# EAGLE schematic Open-Controller-Unitary_V1 (EAGLE 9.1.0)
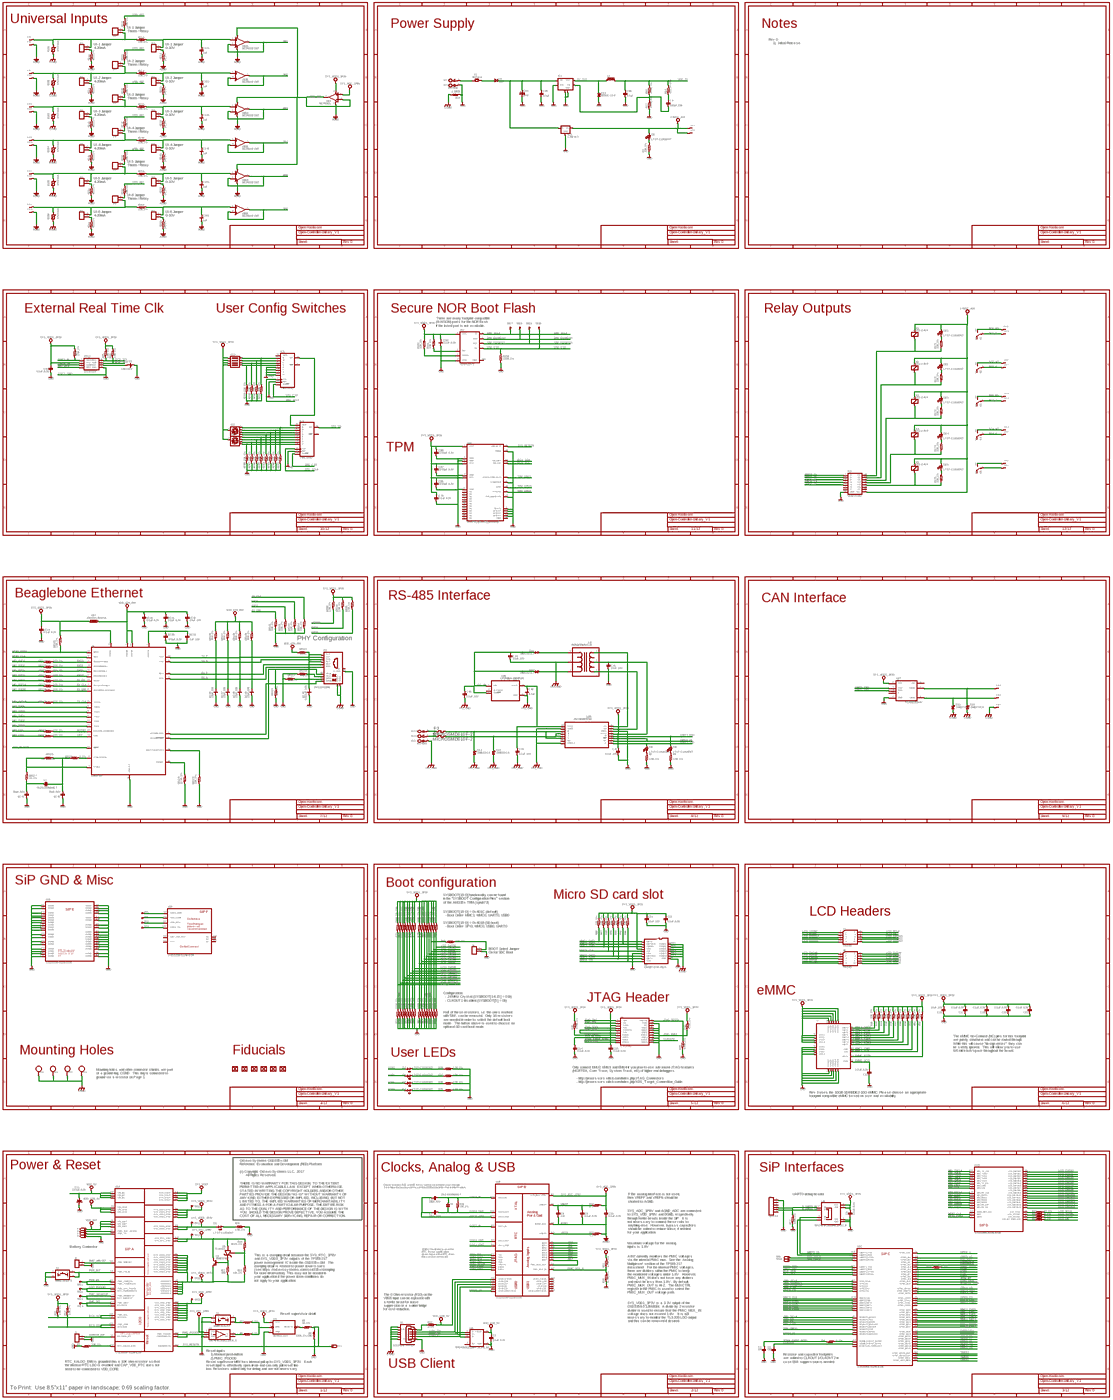
[diagram p0: schematic, sheet 1, overview]
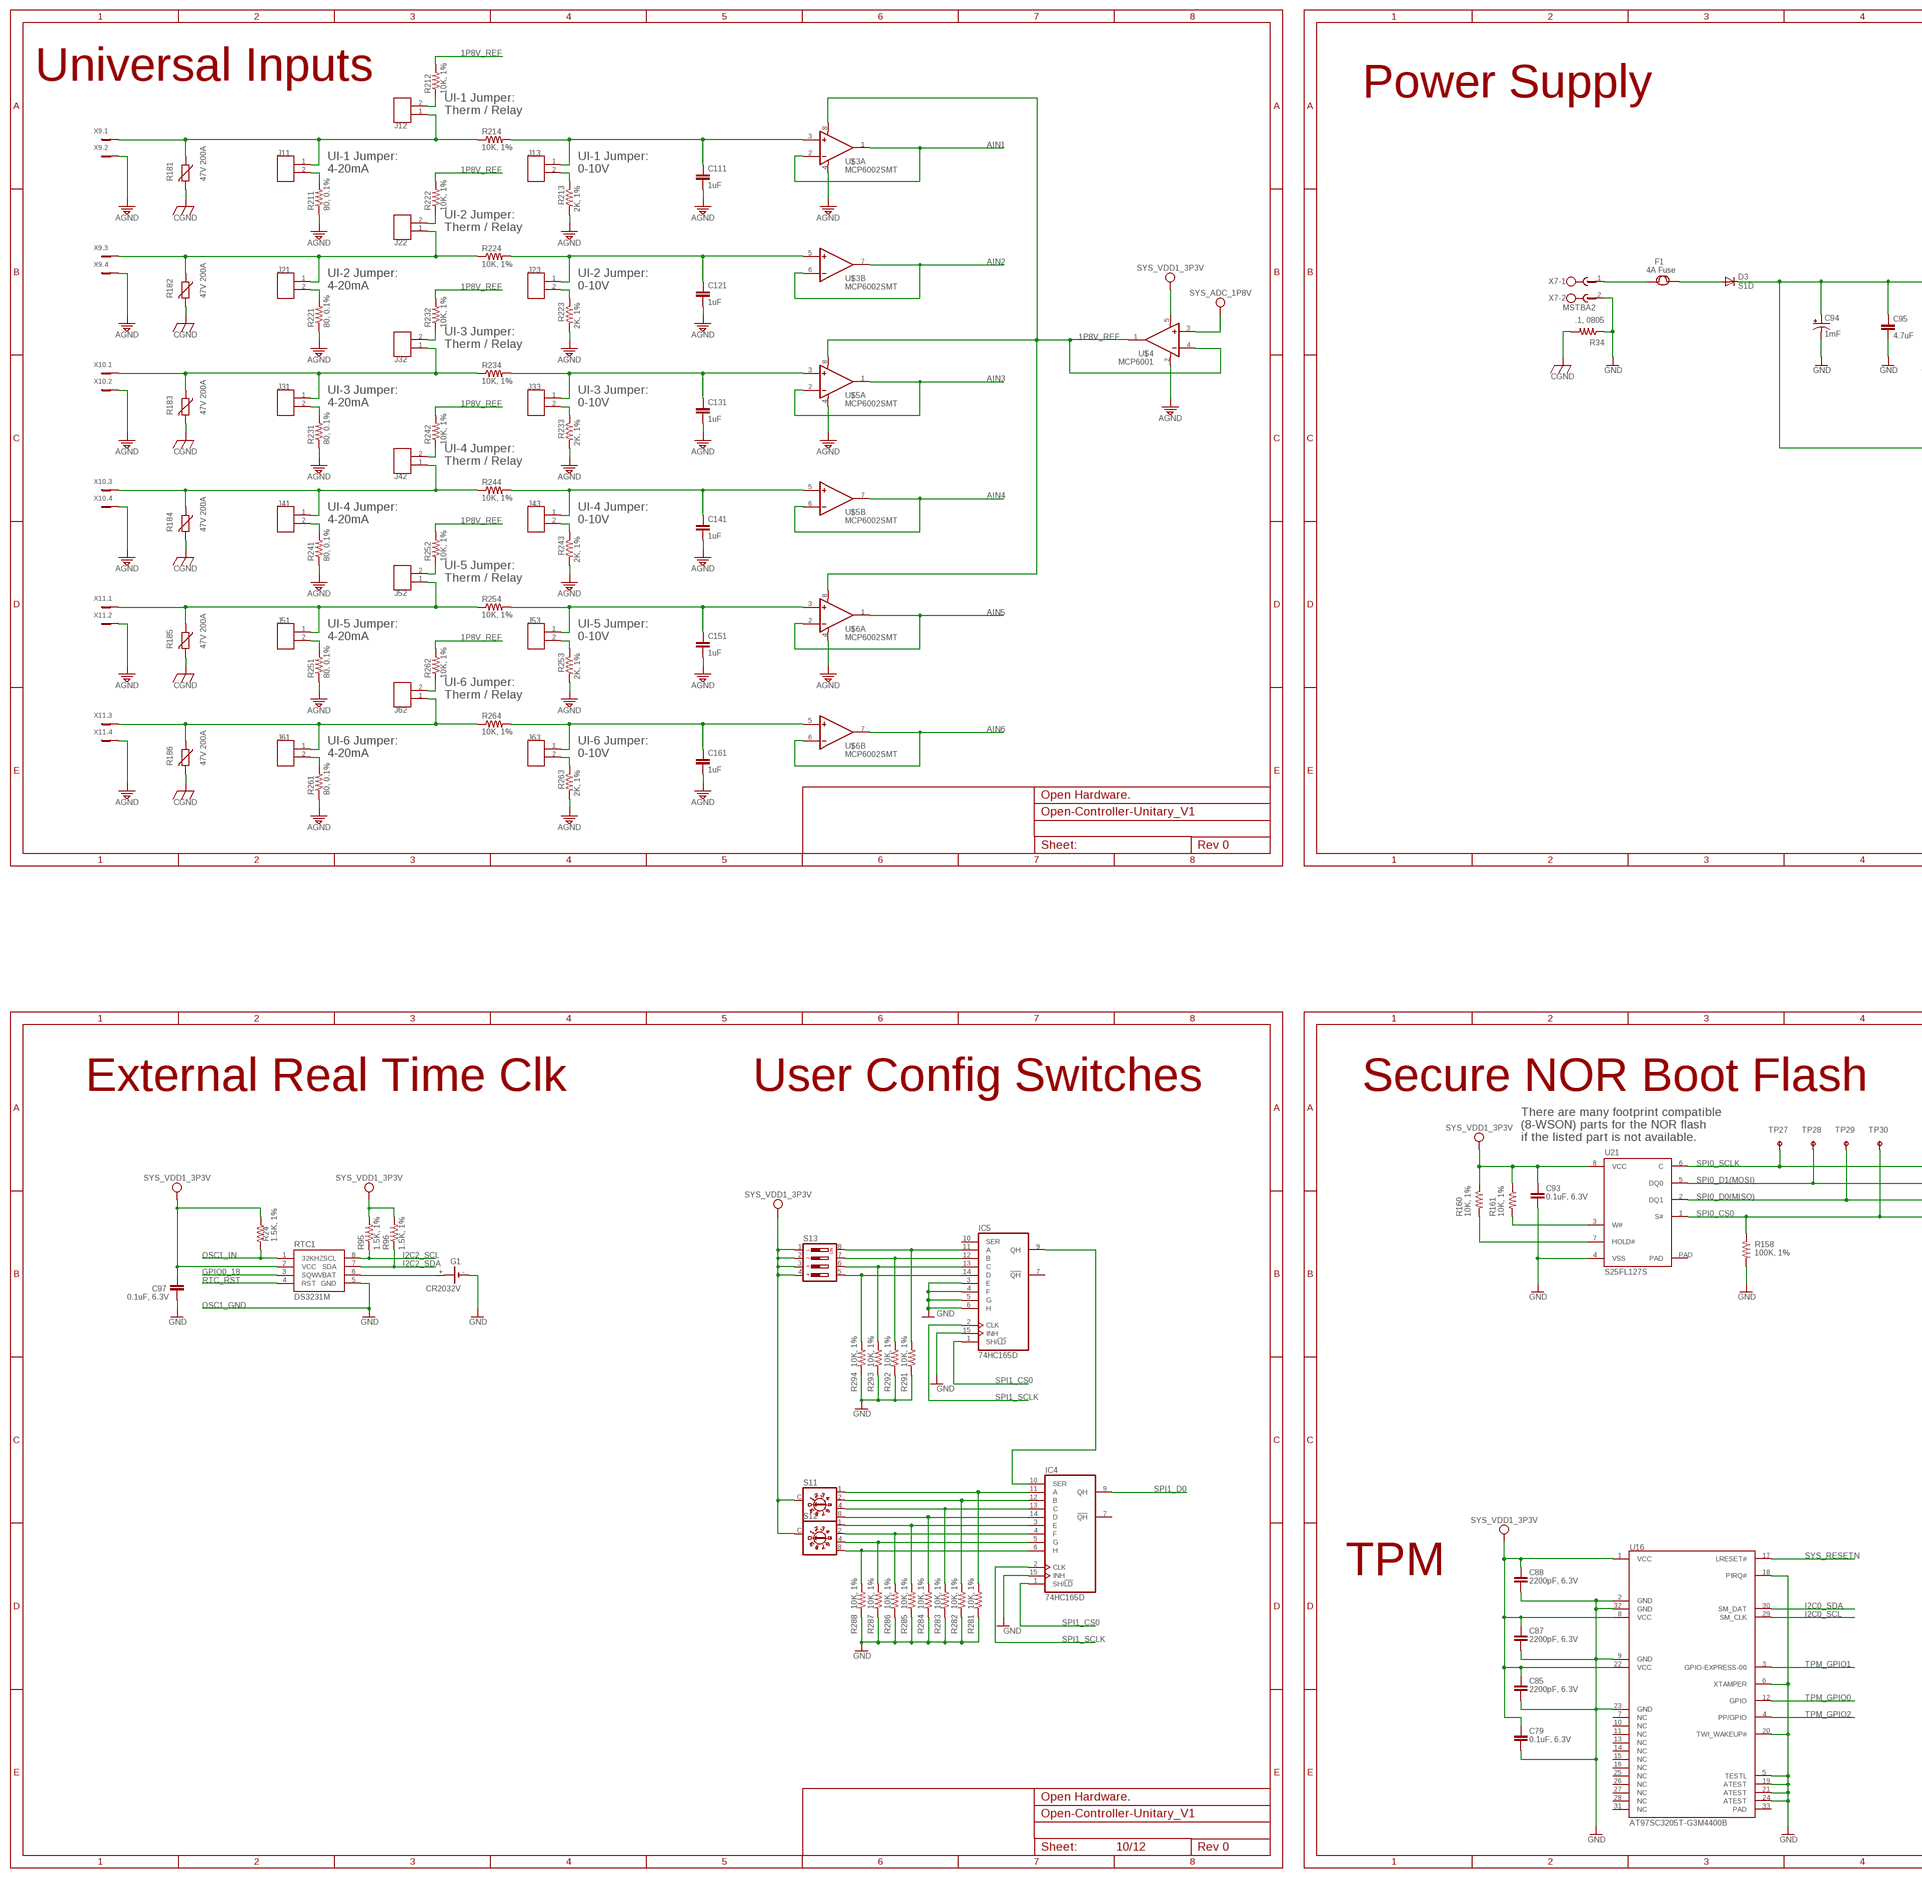
[diagram p1: schematic, sheet 1, part 1 of 6]
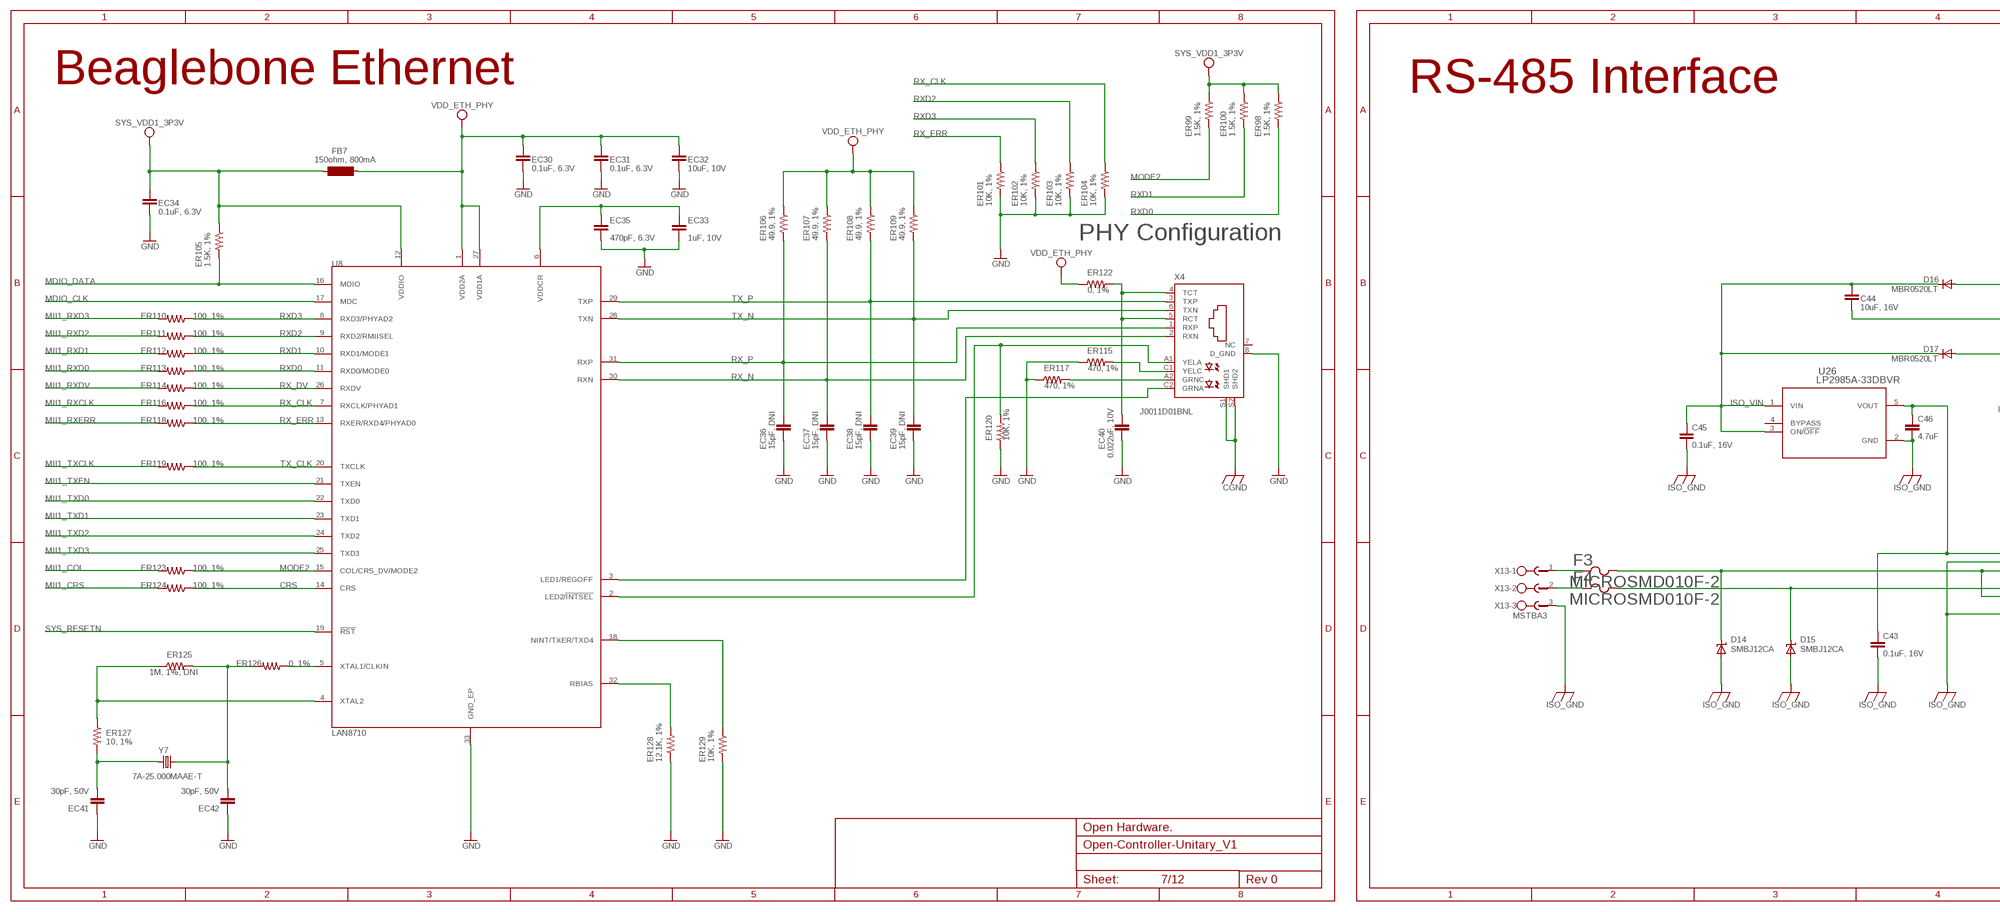
[diagram p2: schematic, sheet 1, part 2 of 6]
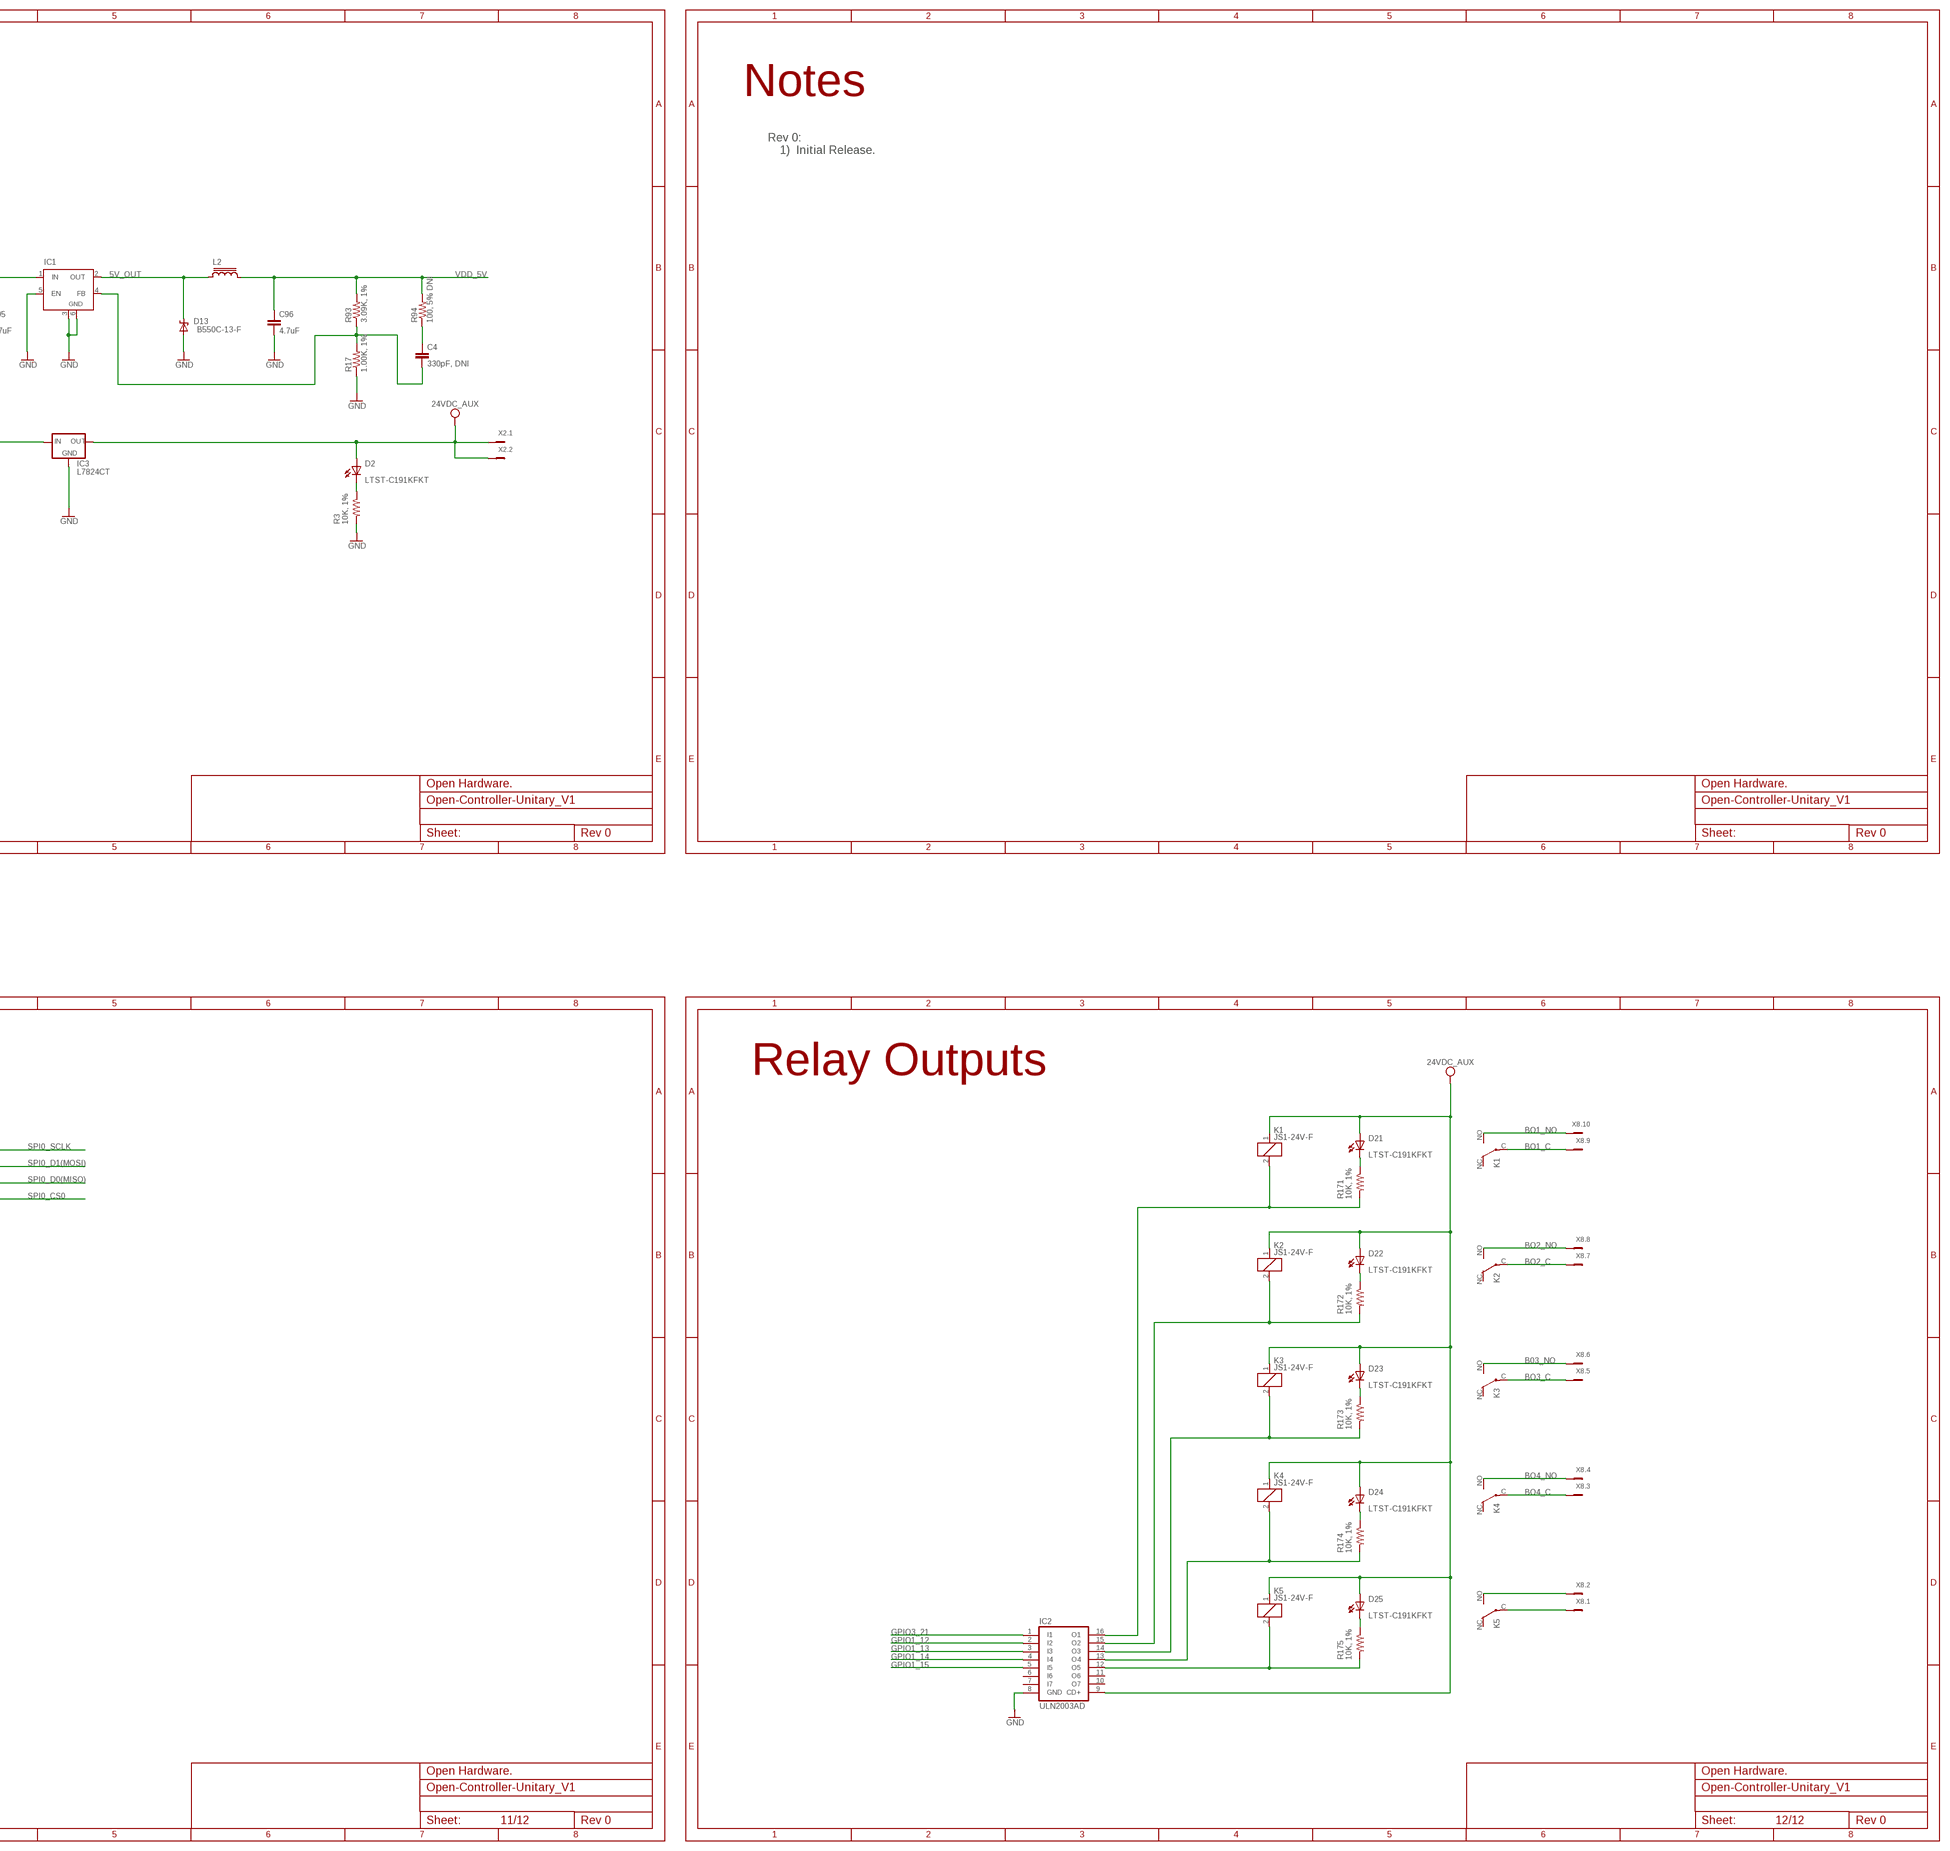
[diagram p3: schematic, sheet 1, part 3 of 6]
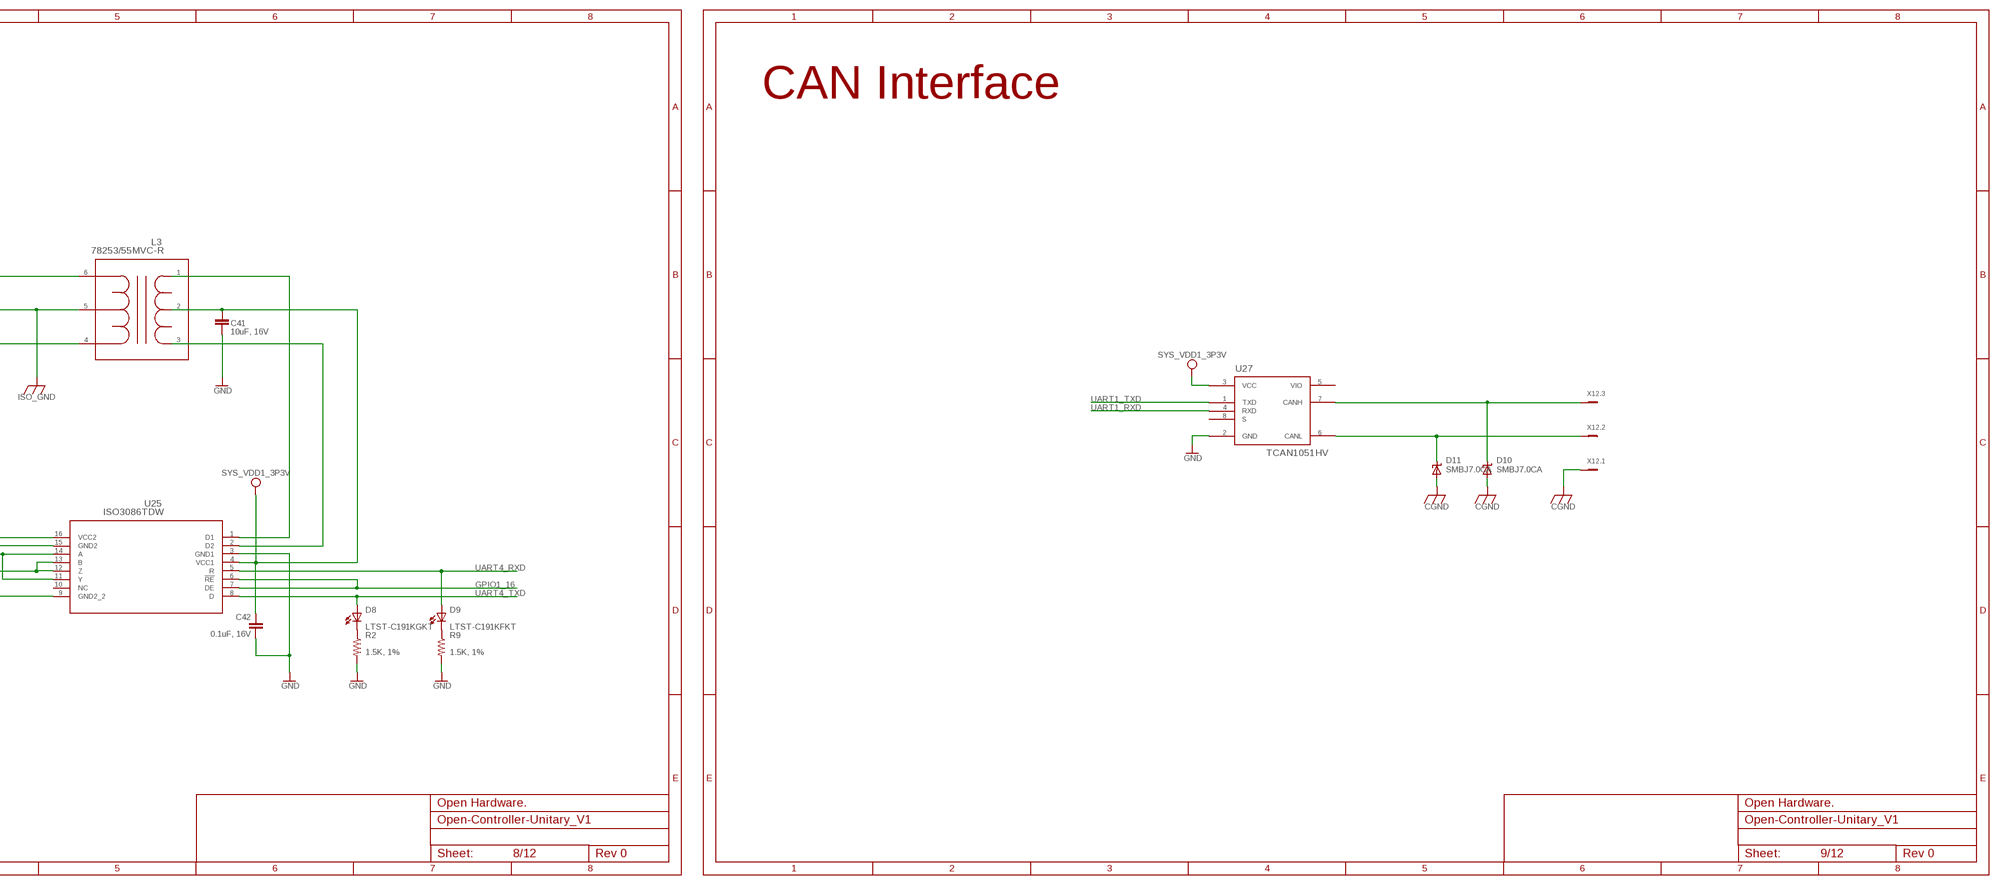
[diagram p4: schematic, sheet 1, part 4 of 6]
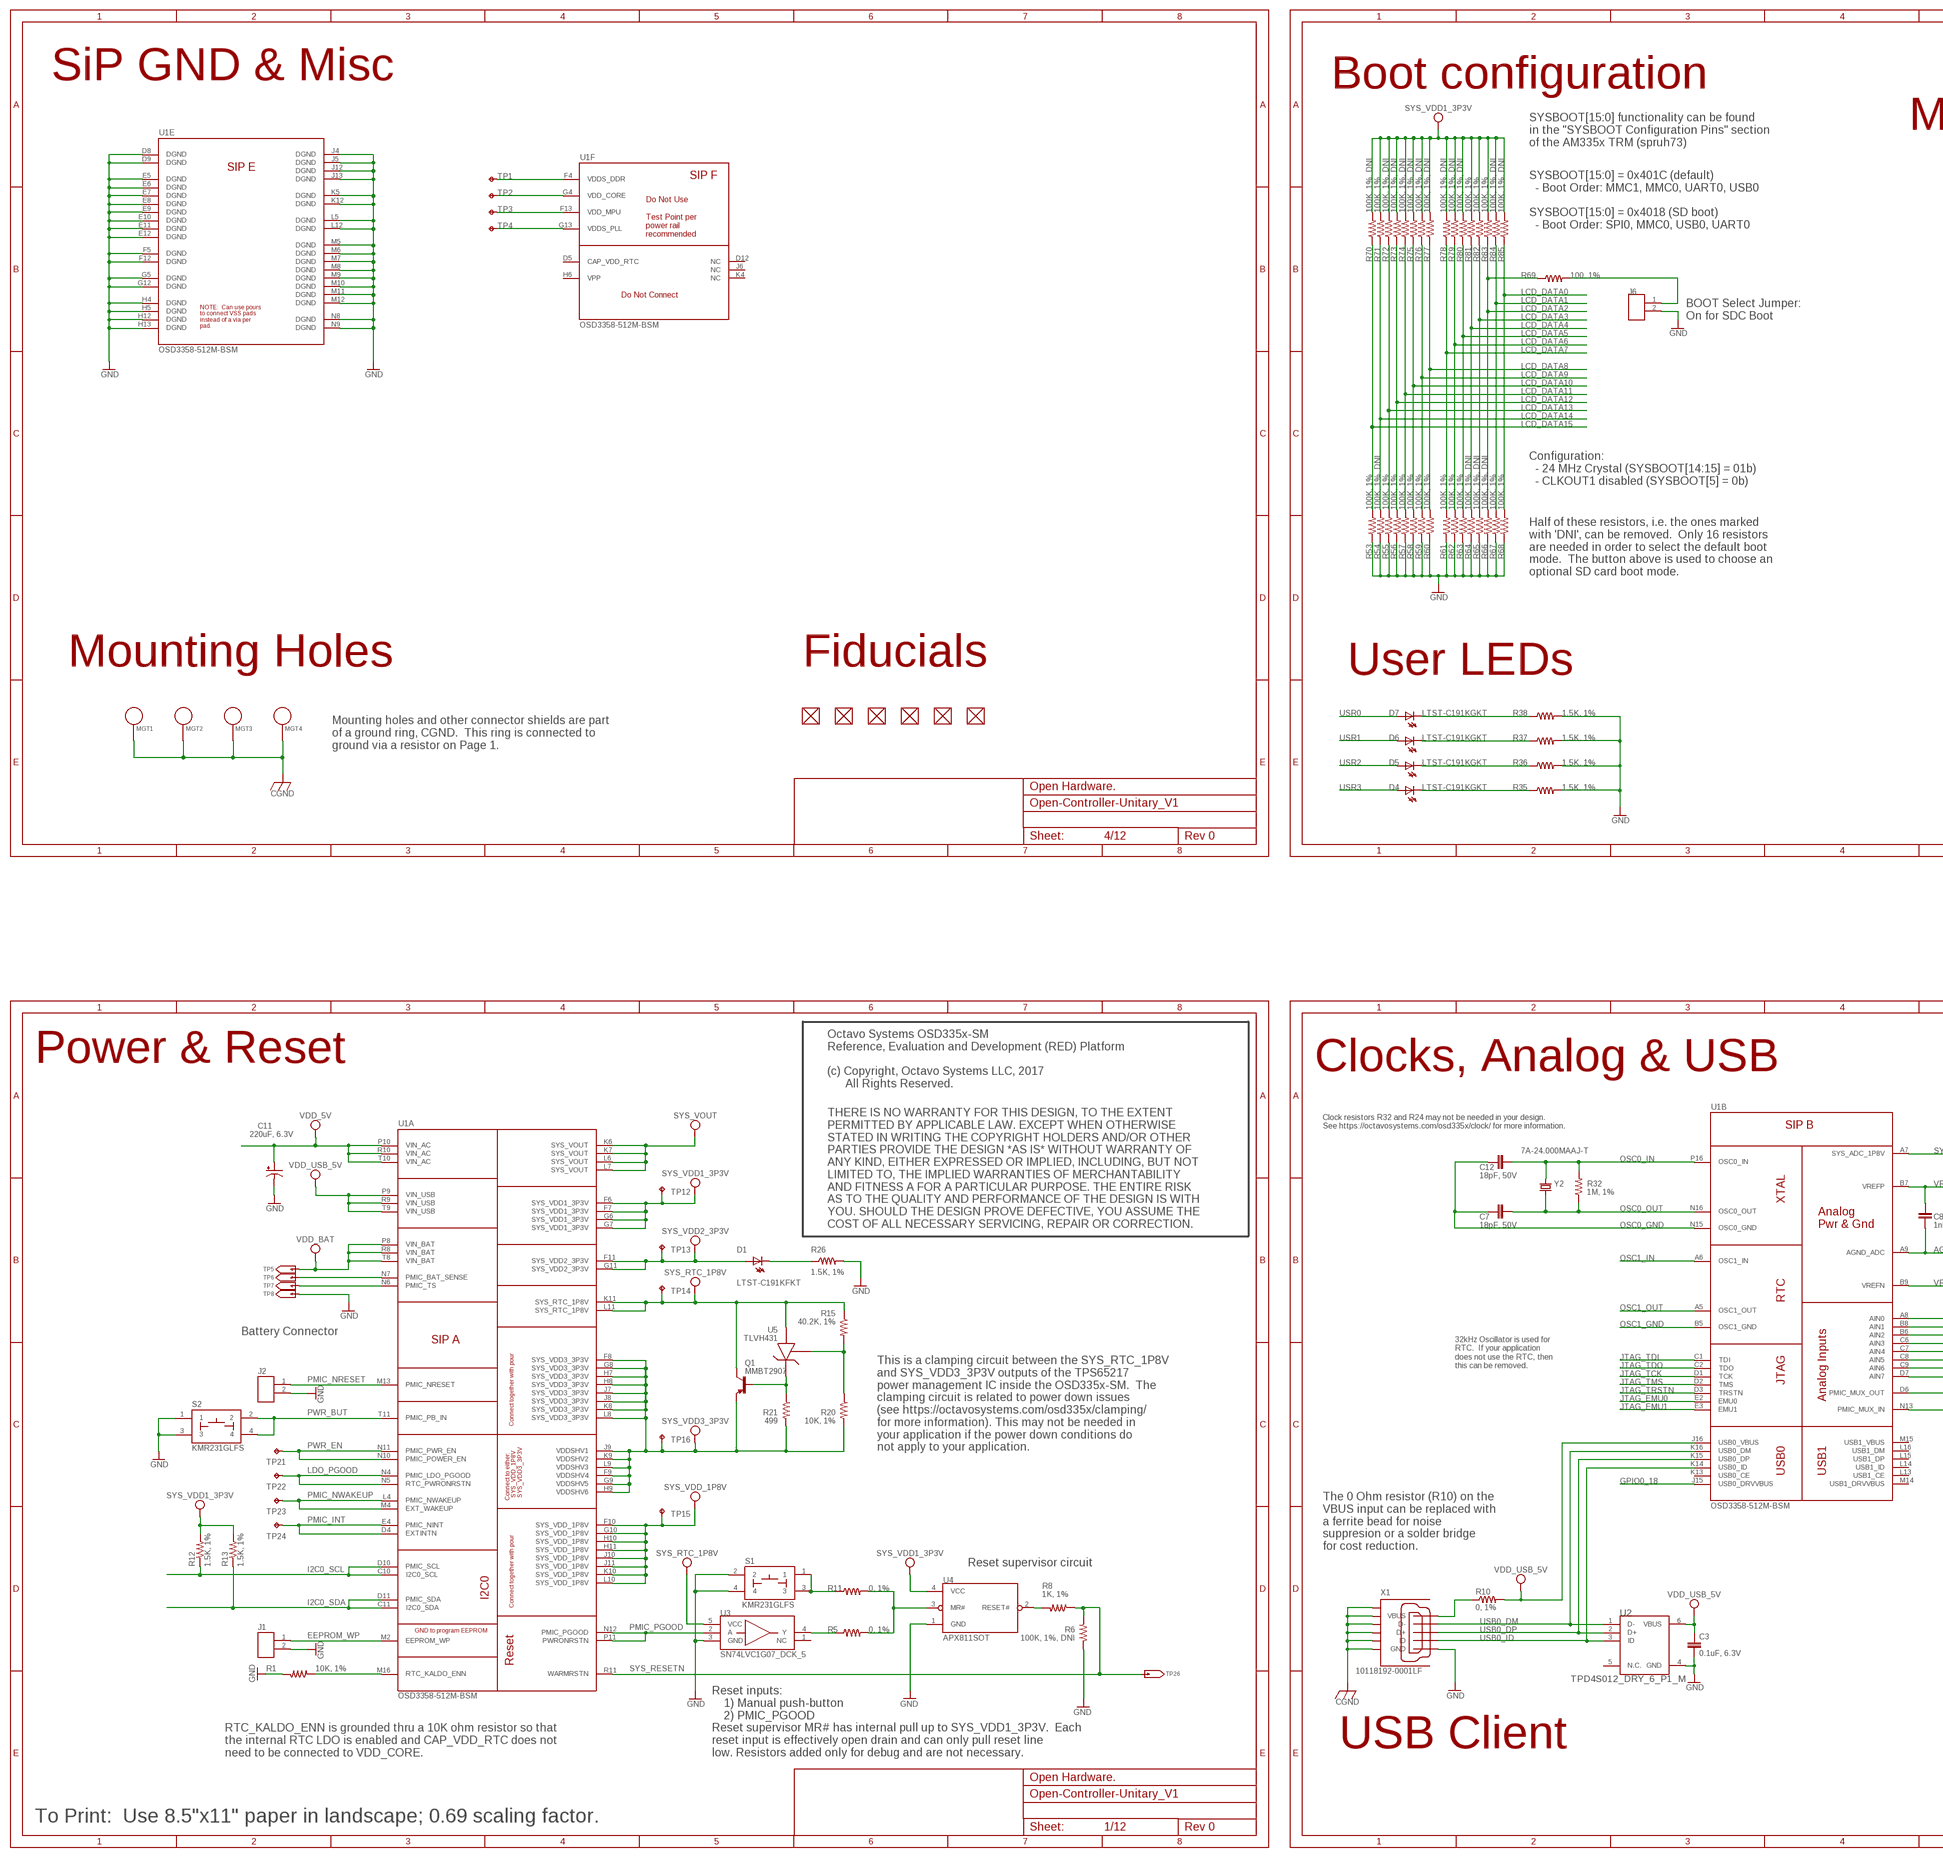
[diagram p5: schematic, sheet 1, part 5 of 6]
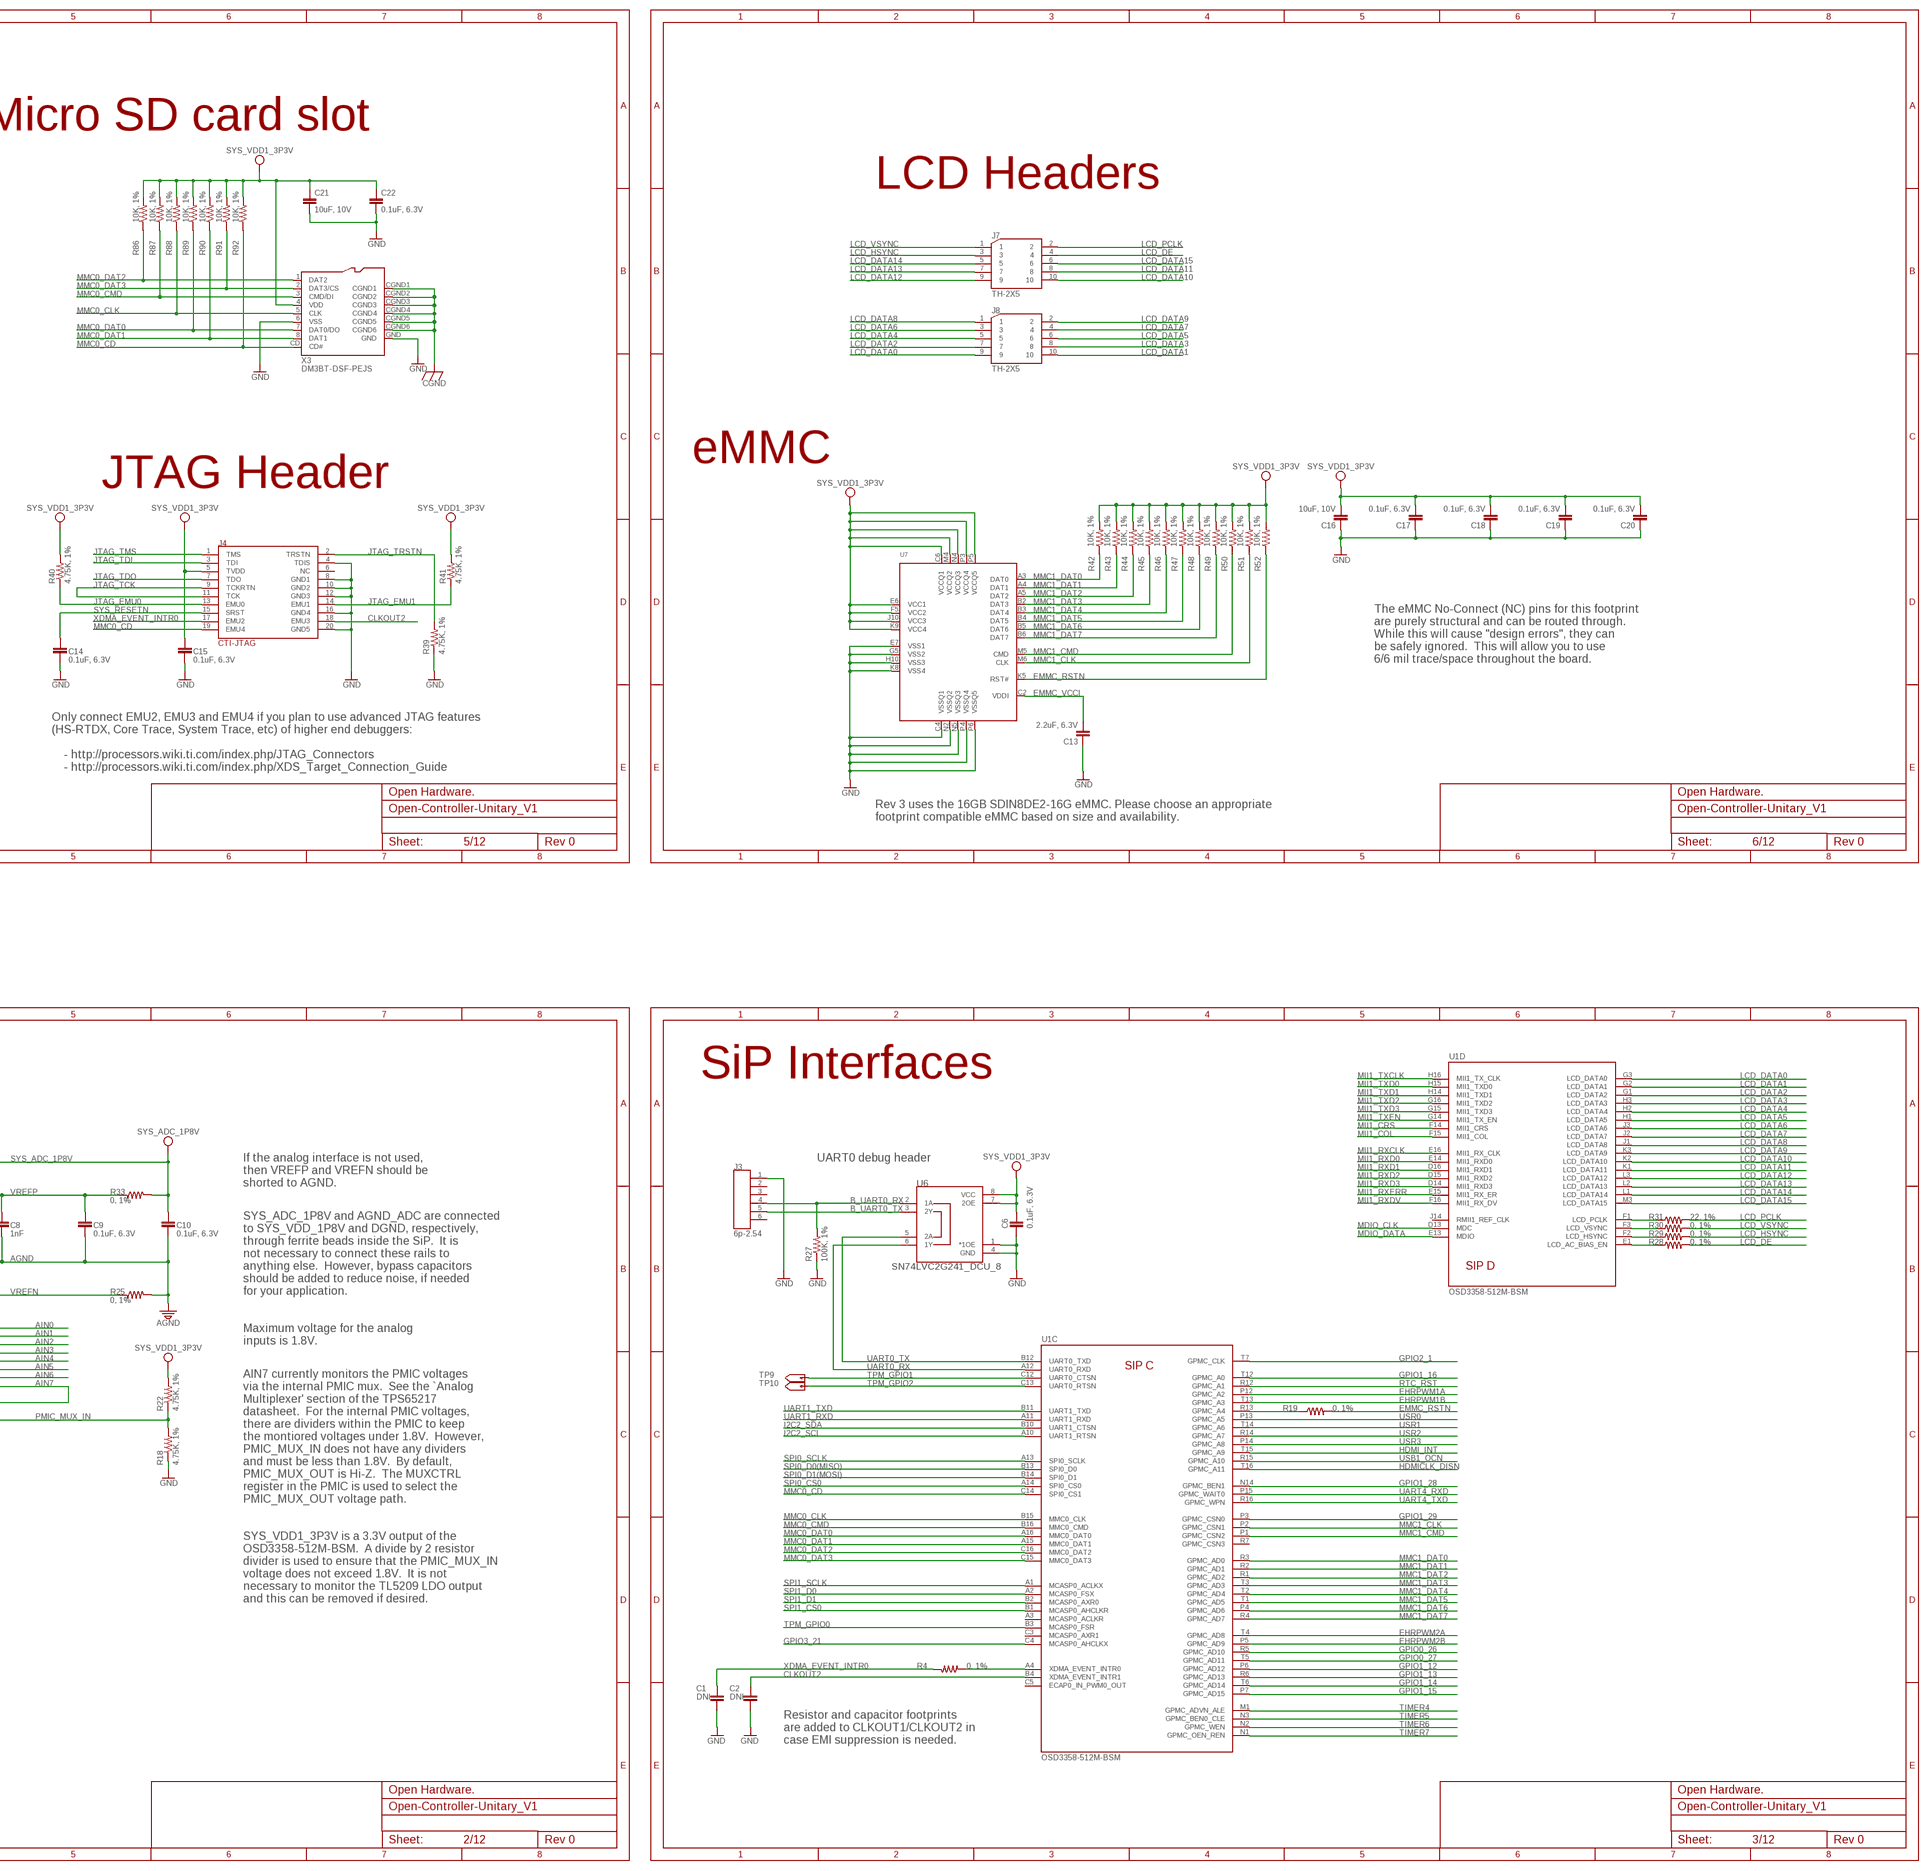
[diagram p6: schematic, sheet 1, part 6 of 6]

## Parts
C1  DNI  CC0603  [C0603]
C2  DNI  CC0603  [C0603]
C3  0.1uF, 6.3V  CC0402  [C0402]
C4  330pF, DNI  CC0805  [C0805]
C6  0.1uF, 6.3V  CC0402  [C0402]
C7  18pF, 50V  CC0402  [C0402]
C8  1nF  CC0402  [C0402]
C9  0.1uF, 6.3V  CC0402  [C0402]
C10  0.1uF, 6.3V  CC0402  [C0402]
C11  220uF, 6.3V  CPOL-USB/3528-21R  [B/3528-21R]
C12  18pF, 50V  CC0402  [C0402]
C13  2.2uF, 6.3V  CC0402  [C0402]
C14  0.1uF, 6.3V  CC0402  [C0402]
C15  0.1uF, 6.3V  CC0402  [C0402]
C16  10uF, 10V  CC0805  [C0805]
C17  0.1uF, 6.3V  CC0402  [C0402]
C18  0.1uF, 6.3V  CC0402  [C0402]
C19  0.1uF, 6.3V  CC0402  [C0402]
C20  0.1uF, 6.3V  CC0402  [C0402]
C21  10uF, 10V  CC0805  [C0805]
C22  0.1uF, 6.3V  CC0402  [C0402]
C41  10uF, 16V  CC0805  [C0805]
C42  0.1uF, 16V  CC0402  [C0402]
C43  0.1uF, 16V  CC0402  [C0402]
C44  10uF, 16V  CC0805  [C0805]
C45  0.1uF, 16V  CC0402  [C0402]
C46  4.7uF  4.7UF-1206-16V-(+80/-20%)  [1206]
C79  0.1uF, 6.3V  CC0402  [C0402]
C85  2200pF, 6.3V  CC0402  [C0402]
C87  2200pF, 6.3V  CC0402  [C0402]
C88  2200pF, 6.3V  CC0402  [C0402]
C93  0.1uF, 6.3V  CC0402  [C0402]
C94  1mF  1000UF-RADIAL-5MM-25V-20%  [CPOL-RADIAL-5MM-10MM]
C95  4.7uF  4.7UF-1206-16V-(+80/-20%)  [1206]
C96  4.7uF  4.7UF-1206-16V-(+80/-20%)  [1206]
C97  0.1uF, 6.3V  CC0402  [C0402]
C111  1uF  CC0805  [C0805]
C121  1uF  CC0805  [C0805]
C131  1uF  CC0805  [C0805]
C141  1uF  CC0805  [C0805]
C151  1uF  CC0805  [C0805]
C161  1uF  CC0805  [C0805]
D1  LTST-C191KFKT  LTST-C191KFKTLED_EIA-STD  [EIA-STD]
D2  LTST-C191KFKT  LTST-C191KFKTLED_EIA-STD  [EIA-STD]
D3  S1D  S1M  [SMA]
D4  LTST-C191KGKT  LTST-C191KGKTLED_EIA-STD  [EIA-STD]
D5  LTST-C191KGKT  LTST-C191KGKTLED_EIA-STD  [EIA-STD]
D6  LTST-C191KGKT  LTST-C191KGKTLED_EIA-STD  [EIA-STD]
D7  LTST-C191KGKT  LTST-C191KGKTLED_EIA-STD  [EIA-STD]
D8  LTST-C191KGKT  LTST-C191KGKTLED_EIA-STD  [EIA-STD]
D9  LTST-C191KFKT  LTST-C191KFKTLED_EIA-STD  [EIA-STD]
D10  SMBJ7.0CA  SUPPRESSOR-SMBJ  [SMBJ]
D11  SMBJ7.0CA  SUPPRESSOR-SMBJ  [SMBJ]
D13  B550C-13-F  B520C-13-F  [SMC]
D14  SMBJ12CA  SUPPRESSOR-SMBJ  [SMBJ]
D15  SMBJ12CA  SUPPRESSOR-SMBJ  [SMBJ]
D16  MBR0520LT  [SOD123]
D17  MBR0520LT  [SOD123]
D21  LTST-C191KFKT  LTST-C191KFKTLED_EIA-STD  [EIA-STD]
D22  LTST-C191KFKT  LTST-C191KFKTLED_EIA-STD  [EIA-STD]
D23  LTST-C191KFKT  LTST-C191KFKTLED_EIA-STD  [EIA-STD]
D24  LTST-C191KFKT  LTST-C191KFKTLED_EIA-STD  [EIA-STD]
D25  LTST-C191KFKT  LTST-C191KFKTLED_EIA-STD  [EIA-STD]
EC30  0.1uF, 6.3V  CC0402  [C0402]
EC31  0.1uF, 6.3V  CC0402  [C0402]
EC32  10uF, 10V  CC0805  [C0805]
EC33  1uF, 10V  CC0402  [C0402]
EC34  0.1uF, 6.3V  CC0402  [C0402]
EC35  470pF, 6.3V  CC0402  [C0402]
EC36  15pF, DNI  CC0402  [C0402]
EC37  15pF, DNI  CC0402  [C0402]
EC38  15pF, DNI  CC0402  [C0402]
EC39  15pF, DNI  CC0402  [C0402]
EC40  0.022uF, 10V  CC0402  [C0402]
EC41  30pF, 50V  CC0402  [C0402]
EC42  30pF, 50V  CC0402  [C0402]
ER98  1.5K, 1%  R-US_R0402  [R0402]
ER99  1.5K, 1%  R-US_R0402  [R0402]
ER100  1.5K, 1%  R-US_R0402  [R0402]
ER101  10K, 1%  R-US_R0402  [R0402]
ER102  10K, 1%  R-US_R0402  [R0402]
ER103  10K, 1%  R-US_R0402  [R0402]
ER104  10K, 1%  R-US_R0402  [R0402]
ER105  1.5K, 1%  R-US_R0402  [R0402]
ER106  49.9, 1%  R-US_R0402  [R0402]
ER107  49.9, 1%  R-US_R0402  [R0402]
ER108  49.9, 1%  R-US_R0402  [R0402]
ER109  49.9, 1%  R-US_R0402  [R0402]
ER110  100, 1%  R-US_R0402  [R0402]
ER111  100, 1%  R-US_R0402  [R0402]
ER112  100, 1%  R-US_R0402  [R0402]
ER113  100, 1%  R-US_R0402  [R0402]
ER114  100, 1%  R-US_R0402  [R0402]
ER115  470, 1%  R-US_R0402  [R0402]
ER116  100, 1%  R-US_R0402  [R0402]
ER117  470, 1%  R-US_R0402  [R0402]
ER118  100, 1%  R-US_R0402  [R0402]
ER119  100, 1%  R-US_R0402  [R0402]
ER120  10K, 1%  R-US_R0402  [R0402]
ER122  0, 1%  R-US_R0402  [R0402]
ER123  100, 1%  R-US_R0402  [R0402]
ER124  100, 1%  R-US_R0402  [R0402]
ER125  1M, 1%, DNI  R-US_R0402  [R0402]
ER126  0, 1%  R-US_R0402  [R0402]
ER127  10, 1%  R-US_R0402  [R0402]
ER128  12.1K, 1%  R-US_R0402  [R0402]
ER129  10K, 1%  R-US_R0402  [R0402]
F1  4A Fuse  FUSE'1206-WIDE'  [F1206W]
F3  MICROSMD010F-2  [FUS_MICROSMD010F_TYCO]
F4  MICROSMD010F-2  [FUS_MICROSMD010F_TYCO]
FB7  150ohm, 800mA  BLM21AG151SN1DFB_0805  [C0805]
FUD1  FIDUCIAL  [FIDUCIAL_40MIL]
FUD2  FIDUCIAL  [FIDUCIAL_40MIL]
FUD3  FIDUCIAL  [FIDUCIAL_40MIL]
FUD4  FIDUCIAL  [FIDUCIAL_40MIL]
FUD5  FIDUCIAL  [FIDUCIAL_40MIL]
FUD6  FIDUCIAL  [FIDUCIAL_40MIL]
G1  CR2032V  [CR2032V]
IC1  LM2596S  [TO263-5]
IC2  ULN2003AD  [SO16]
IC3  L7824CT  78XXL  [78XXL]
IC4  74HC165D  [SO16]
IC5  74HC165D  [SO16]
J1  826646-2  [H2-2.54]
J2  826646-2  [H2-2.54]
J3  6p-2.54  826646-6  [H6-2.54]
J4  CTI-JTAG  [CTI-JTAG]
J6  826646-2  [H2-2.54]
J7  TH-2X5  [H2X5-2.54]
J8  TH-2X5  [H2X5-2.54]
J11  826646-2  [H2-2.54]
J12  826646-2  [H2-2.54]
J13  826646-2  [H2-2.54]
J21  826646-2  [H2-2.54]
J22  826646-2  [H2-2.54]
J23  826646-2  [H2-2.54]
J31  826646-2  [H2-2.54]
J32  826646-2  [H2-2.54]
J33  826646-2  [H2-2.54]
J41  826646-2  [H2-2.54]
J42  826646-2  [H2-2.54]
J43  826646-2  [H2-2.54]
J51  826646-2  [H2-2.54]
J52  826646-2  [H2-2.54]
J53  826646-2  [H2-2.54]
J61  826646-2  [H2-2.54]
J62  826646-2  [H2-2.54]
J63  826646-2  [H2-2.54]
K1  JS1-24V-F  JS-M1-12V-5  [JS-M]
K2  JS1-24V-F  JS-M1-12V-5  [JS-M]
K3  JS1-24V-F  JS-M1-12V-5  [JS-M]
K4  JS1-24V-F  JS-M1-12V-5  [JS-M]
K5  JS1-24V-F  JS-M1-12V-5  [JS-M]
L2  MSS1260  [MSS1260]
L3  78253/55MVC-R  [IND_78253_MC]
MGT1  MOUNTING_HOLE  [MOUNTING_HOLE]
MGT2  MOUNTING_HOLE  [MOUNTING_HOLE]
MGT3  MOUNTING_HOLE  [MOUNTING_HOLE]
MGT4  MOUNTING_HOLE  [MOUNTING_HOLE]
Q1  MMBT2907  MMBT2907SMD  [SOT23-BEC]
R1  10K, 1%  R-US_R0402  [R0402]
R2  1.5K, 1%  R-US_R0402  [R0402]
R3  10K, 1%  R-US_R0402  [R0402]
R4  0, 1%  R-US_R0402  [R0402]
R5  0, 1%  R-US_R0402  [R0402]
R6  100K, 1%, DNI  R-US_R0402  [R0402]
R8  1K, 1%  R-US_R0402  [R0402]
R9  1.5K, 1%  R-US_R0402  [R0402]
R10  0, 1%  R-US_R0805  [R0805]
R11  0, 1%  R-US_R0402  [R0402]
R12  1.5K, 1%  R-US_R0402  [R0402]
R13  1.5K, 1%  R-US_R0402  [R0402]
R15  40.2K, 1%  R-US_R0402  [R0402]
R17  1.00K, 1%  R-US_R0805  [R0805]
R18  4.75K, 1%  R-US_R0402  [R0402]
R19  0, 1%  R-US_R0402  [R0402]
R20  10K, 1%  R-US_R0402  [R0402]
R21  499  R-US_R0402  [R0402]
R22  4.75K, 1%  R-US_R0402  [R0402]
R24  1.5K, 1%  R-US_R0402  [R0402]
R25  0, 1%  R-US_R0402  [R0402]
R26  1.5K, 1%  R-US_R0402  [R0402]
R27  100K, 1%  R-US_R0402  [R0402]
R28  0, 1%  R-US_R0402  [R0402]
R29  0, 1%  R-US_R0402  [R0402]
R30  0, 1%  R-US_R0402  [R0402]
R31  22, 1%  R-US_R0402  [R0402]
R32  1M, 1%  R-US_R0402  [R0402]
R33  0, 1%  R-US_R0402  [R0402]
R34  .1, 0805  R-US_R0805  [R0805]
R35  1.5K, 1%  R-US_R0402  [R0402]
R36  1.5K, 1%  R-US_R0402  [R0402]
R37  1.5K, 1%  R-US_R0402  [R0402]
R38  1.5K, 1%  R-US_R0402  [R0402]
R39  4.75K, 1%  R-US_R0402  [R0402]
R40  4.75K, 1%  R-US_R0402  [R0402]
R41  4.75K, 1%  R-US_R0402  [R0402]
R42  10K, 1%  R-US_R0402  [R0402]
R43  10K, 1%  R-US_R0402  [R0402]
R44  10K, 1%  R-US_R0402  [R0402]
R45  10K, 1%  R-US_R0402  [R0402]
R46  10K, 1%  R-US_R0402  [R0402]
R47  10K, 1%  R-US_R0402  [R0402]
R48  10K, 1%  R-US_R0402  [R0402]
R49  10K, 1%  R-US_R0402  [R0402]
R50  10K, 1%  R-US_R0402  [R0402]
R51  10K, 1%  R-US_R0402  [R0402]
R52  10K, 1%  R-US_R0402  [R0402]
R53  100K, 1%  R-US_R0402  [R0402]
R54  100K, 1%, DNI  R-US_R0402  [R0402]
R55  100K, 1%  R-US_R0402  [R0402]
R56  100K, 1%  R-US_R0402  [R0402]
R57  100K, 1%  R-US_R0402  [R0402]
R58  100K, 1%  R-US_R0402  [R0402]
R59  100K, 1%  R-US_R0402  [R0402]
R60  100K, 1%  R-US_R0402  [R0402]
R61  100K, 1%  R-US_R0402  [R0402]
R62  100K, 1%  R-US_R0402  [R0402]
R63  100K, 1%  R-US_R0402  [R0402]
R64  100K, 1%, DNI  R-US_R0402  [R0402]
R65  100K, 1%, DNI  R-US_R0402  [R0402]
R66  100K, 1%, DNI  R-US_R0402  [R0402]
R67  100K, 1%  R-US_R0402  [R0402]
R68  100K, 1%  R-US_R0402  [R0402]
R69  100, 1%  R-US_R0402  [R0402]
R70  100K, 1%, DNI  R-US_R0402  [R0402]
R71  100K, 1%  R-US_R0402  [R0402]
R72  100K, 1%, DNI  R-US_R0402  [R0402]
R73  100K, 1%, DNI  R-US_R0402  [R0402]
R74  100K, 1%, DNI  R-US_R0402  [R0402]
R75  100K, 1%, DNI  R-US_R0402  [R0402]
R76  100K, 1%, DNI  R-US_R0402  [R0402]
R77  100K, 1%, DNI  R-US_R0402  [R0402]
R78  100K, 1%, DNI  R-US_R0402  [R0402]
R79  100K, 1%, DNI  R-US_R0402  [R0402]
R80  100K, 1%, DNI  R-US_R0402  [R0402]
R81  100K, 1%  R-US_R0402  [R0402]
R82  100K, 1%  R-US_R0402  [R0402]
R83  100K, 1%  R-US_R0402  [R0402]
R84  100K, 1%, DNI  R-US_R0402  [R0402]
R85  100K, 1%, DNI  R-US_R0402  [R0402]
R86  10K, 1%  R-US_R0402  [R0402]
R87  10K, 1%  R-US_R0402  [R0402]
R88  10K, 1%  R-US_R0402  [R0402]
R89  10K, 1%  R-US_R0402  [R0402]
R90  10K, 1%  R-US_R0402  [R0402]
R91  10K, 1%  R-US_R0402  [R0402]
R92  10K, 1%  R-US_R0402  [R0402]
R93  3.09K, 1%  R-US_R0805  [R0805]
R94  100, 5% DNI  R-US_R0805  [R0805]
R95  1.5K, 1%  R-US_R0402  [R0402]
R96  1.5K, 1%  R-US_R0402  [R0402]
R158  100K, 1%  R-US_R0402  [R0402]
R160  10K, 1%  R-US_R0402  [R0402]
R161  10K, 1%  R-US_R0402  [R0402]
R171  10K, 1%  R-US_R0402  [R0402]
R172  10K, 1%  R-US_R0402  [R0402]
R173  10K, 1%  R-US_R0402  [R0402]
R174  10K, 1%  R-US_R0402  [R0402]
R175  10K, 1%  R-US_R0402  [R0402]
R181  47V 200A  VARISTORCN1206  [CT/CN1206]
R182  47V 200A  VARISTORCN1206  [CT/CN1206]
R183  47V 200A  VARISTORCN1206  [CT/CN1206]
R184  47V 200A  VARISTORCN1206  [CT/CN1206]
R185  47V 200A  VARISTORCN1206  [CT/CN1206]
R186  47V 200A  VARISTORCN1206  [CT/CN1206]
R211  80, 0.1%  R-US_0309/12  [0309/12]
R212  10K, 1%  R-US_R0805  [R0805]
R213  2K, 1%  R-US_R0805  [R0805]
R214  10K, 1%  R-US_R0805  [R0805]
R221  80, 0.1%  R-US_0309/12  [0309/12]
R222  10K, 1%  R-US_R0805  [R0805]
R223  2K, 1%  R-US_R0805  [R0805]
R224  10K, 1%  R-US_R0805  [R0805]
R231  80, 0.1%  R-US_0309/12  [0309/12]
R232  10K, 1%  R-US_R0805  [R0805]
R233  2K, 1%  R-US_R0805  [R0805]
R234  10K, 1%  R-US_R0805  [R0805]
R241  80, 0.1%  R-US_0309/12  [0309/12]
R242  10K, 1%  R-US_R0805  [R0805]
R243  2K, 1%  R-US_R0805  [R0805]
R244  10K, 1%  R-US_R0805  [R0805]
R251  80, 0.1%  R-US_0309/12  [0309/12]
R252  10K, 1%  R-US_R0805  [R0805]
R253  2K, 1%  R-US_R0805  [R0805]
R254  10K, 1%  R-US_R0805  [R0805]
R261  80, 0.1%  R-US_0309/12  [0309/12]
R262  10K, 1%  R-US_R0805  [R0805]
R263  2K, 1%  R-US_R0805  [R0805]
R264  10K, 1%  R-US_R0805  [R0805]
R281  10K, 1%  R-US_R0402  [R0402]
R282  10K, 1%  R-US_R0402  [R0402]
R283  10K, 1%  R-US_R0402  [R0402]
R284  10K, 1%  R-US_R0402  [R0402]
R285  10K, 1%  R-US_R0402  [R0402]
R286  10K, 1%  R-US_R0402  [R0402]
R287  10K, 1%  R-US_R0402  [R0402]
R288  10K, 1%  R-US_R0402  [R0402]
R291  10K, 1%  R-US_R0402  [R0402]
R292  10K, 1%  R-US_R0402  [R0402]
R293  10K, 1%  R-US_R0402  [R0402]
R294  10K, 1%  R-US_R0402  [R0402]
RTC1  DS3231M  [SO08]
S1  KMR231GLFS  [SW4SMD_63X161LS]
S2  KMR231GLFS  [SW4SMD_63X161LS]
S11  P101  [P101]
S12  P101  [P101]
S13  DS04  [DS-04]
TP1  TPB0,65  [TP_B0,65]
TP2  TPB0,65  [TP_B0,65]
TP3  TPB0,65  [TP_B0,65]
TP4  TPB0,65  [TP_B0,65]
TP5  TESTPAD/W_HOLE_1X1  [TESTPAD/W_HOLE_1X1]
TP6  TESTPAD/W_HOLE_1X1  [TESTPAD/W_HOLE_1X1]
TP7  TESTPAD/W_HOLE_1X1  [TESTPAD/W_HOLE_1X1]
TP8  TESTPAD/W_HOLE_1X1  [TESTPAD/W_HOLE_1X1]
TP9  TESTPAD/W_HOLE_1X1  [TESTPAD/W_HOLE_1X1]
TP10  TESTPAD/W_HOLE_1X1  [TESTPAD/W_HOLE_1X1]
TP12  TPB0,65  [TP_B0,65]
TP13  TPB0,65  [TP_B0,65]
TP14  TPB0,65  [TP_B0,65]
TP15  TPB0,65  [TP_B0,65]
TP16  TPB0,65  [TP_B0,65]
TP21  TPB0,65  [TP_B0,65]
TP22  TPB0,65  [TP_B0,65]
TP23  TPB0,65  [TP_B0,65]
TP24  TPB0,65  [TP_B0,65]
TP26  TESTPAD/W_HOLE_1X1  [TESTPAD/W_HOLE_1X1]
TP27  TPB0,65  [TP_B0,65]
TP28  TPB0,65  [TP_B0,65]
TP29  TPB0,65  [TP_B0,65]
TP30  TPB0,65  [TP_B0,65]
U1  OSD3358-512M-BSM  [OSD335X-BGA-256]
U2  TPD4S012_DRY_6_P1_M  [DRY6]
U3  SN74LVC1G07_DCK_5  [DCK5]
U4  APX811SOT  [SOT143-R]
U5  TLVH431  [SOT23-3]
U6  SN74LVC2G241_DCU_8  [DCU8]
U7  EMMC04G-S100-B08U  [MICRON_EMMC_153]
U8  LAN8710  [LAN8710A-QFN32]
U16  AT97SC3205T-G3M4400B  [QFN32-0.4-4X4MM]
U21  S25FL127S  [W-PDFN-8]
U25  ISO3086TDW  [DW16]
U26  LP2985A-33DBVR  [DBV5]
U27  TCAN1051HV  [BEAGLEBONE_BLUE_D8]
U$3  MCP6002SMT  [SOIC8]
U$4  MCP6001  [SOT23-5]
U$5  MCP6002SMT  [SOIC8]
U$6  MCP6002SMT  [SOIC8]
X1  10118192-0001LF  [10118192-0001LF(MICRO-USB-B-AMPHENOL-FCI)]
X2  MC2  [MC2]
X3  DM3BT-DSF-PEJS  [DM3BT-DSF-PEJS]
X4  J0011D01BNL  LPJ0011BBNL  [SI-50170]
X7  MSTBA2  [MSTBA2]
X8  MC10  [MC10]
X9  MC4  [MC4]
X10  MC4  [MC4]
X11  MC4  [MC4]
X12  MC3  [MC3]
X13  MSTBA3  [MSTBA3]
Y2  7A-24.000MAAJ-T  [CRYSTAL-TXC-7A]
Y7  7A-25.000MAAE-T  [CRYSTAL-TXC-7A]

## Nets
1P8V_REF: R212.2 R222.2 R232.2 R242.2 R252.2 R262.2 U$3.8(A:V+) U$4.1(OUT) U$4.4(-IN) U$5.8(A:V+) U$6.8(A:V+)
5V_OUT: D13.C IC1.2(OUT) L2.1
24VAC: D3.A F1.2
24VAC_IN: F1.1 X7.1
24VAC_UNREG: C94.+ C95.1 D3.C IC1.1(IN) IC3.IN
24VDC_AUX: D2.1(A) D21.1(A) D22.1(A) D23.1(A) D24.1(A) D25.1(A) IC2.9(CD+) IC3.OUT K1.1 K2.1 K3.1 K4.1 K5.1 X2.1 X2.2
AGND: C8.2 C9.2 C10.2 C111.2 C121.2 C131.2 C141.2 C151.2 C161.2 R25.2 R211.1 R213.2 R221.1 R223.2 R231.1 R233.2 R241.1 R243.2 R251.1 R253.2 R261.1 R263.2 U1.A9(B:AGND_ADC) U$3.4(A:V-) U$4.2(V-) U$5.4(A:V-) U$6.4(A:V-) X9.2 X9.4 X10.2 X10.4 X11.2 X11.4
AIN0: U1.A8(B:AIN0)
AIN1: U1.B8(B:AIN1) U$3.1(A:OUT) U$3.2(A:-IN)
AIN2: U1.B6(B:AIN2) U$3.6(B:-IN) U$3.7(B:OUT)
AIN3: U1.C6(B:AIN3) U$5.1(A:OUT) U$5.2(A:-IN)
AIN4: U1.C7(B:AIN4) U$5.6(B:-IN) U$5.7(B:OUT)
AIN5: U1.C8(B:AIN5) U$6.1(A:OUT) U$6.2(A:-IN)
AIN6: U1.C9(B:AIN6) U$6.6(B:-IN) U$6.7(B:OUT)
AIN7: U1.D6(B:PMIC_MUX_OUT) U1.D7(B:AIN7)
B03_NO: K3.NO(2:S) X8.6
B_UART0_RX: J3.4 R27.2 U6.2(1A)
B_UART0_TX: J3.5 U6.3(2Y)
BAT_SENSE: TP6.P$1(TP) U1.N7(A:PMIC_BAT_SENSE)
BO1_C: K1.C(2:P) X8.9
BO1_NO: K1.NO(2:S) X8.10
BO2_C: K2.C(2:P) X8.7
BO2_NO: K2.NO(2:S) X8.8
BO3_C: K3.C(2:P) X8.5
BO4_C: K4.C(2:P) X8.3
BO4_NO: K4.NO(2:S) X8.4
BO5_C: K5.C(2:P) X8.1
BO5_NO: K5.NO(2:S) X8.2
CGND: D10.A D11.A MGT1.P$1 MGT2.P$1 MGT3.P$1 MGT4.P$1 R34.2 R181.2 R182.2 R183.2 R184.2 R185.2 R186.2 X1.CGND1(SGND1) X1.CGND2(SGND2) X1.CGND3(SGND3) X1.CGND4(SGND4) X1.CGND5(SGND5) X1.CGND6(SGND6) X3.CGND1 X3.CGND2 X3.CGND3 X3.CGND4 X3.CGND5 X3.CGND6 X4.S1(SHD1) X4.S2(SHD2) X12.1
CLKOUT2: C2.2 J4.18(EMU3) U1.B4(C:XDMA_EVENT_INTR1)
CRS: ER124.1 U8.14(CRS)
EEPROM_WP: J1.1 U1.M2(A:EEPROM_WP)
EHRPWM1A: U1.P12(C:GPMC_A2)
EHRPWM1B: U1.T13(C:GPMC_A3)
EHRPWM2A: U1.T4(C:GPMC_AD8)
EHRPWM2B: U1.P5(C:GPMC_AD9)
EMMC_RSTN: R19.2 R52.1 U7.K5(RST#)
EMMC_VCCI: C13.2 U7.C2(VDDI)
GND: C1.1 C2.1 C3.2 C6.1 C11.- C13.1 C14.2 C15.2 C16.1 C17.1 C18.1 C19.1 C20.1 C21.2 C22.2 C41.2 C42.2 C79.2 C85.2 C87.2 C88.2 C93.2 C94.- C95.2 C96.2 C97.2 D13.A EC30.2 EC31.2 EC32.2 EC33.2 EC34.2 EC35.2 EC36.2 EC37.2 EC38.2 EC39.2 EC40.2 EC41.2 EC42.2 ER101.2 ER102.2 ER103.2 ER104.2 ER115.1 ER117.1 ER120.1 ER128.1 ER129.2 G1.- IC1.3(GND) IC1.5(EN) IC1.6(GND) IC2.8(GND) IC3.GND IC4.15(INH) IC5.3(E) IC5.4(F) IC5.5(G) IC5.6(H) IC5.15(INH) J1.2 J2.2 J3.1 J4.4(TDIS) J4.8(GND1) J4.10(GND2) J4.12(GND3) J4.16(GND4) J4.20(GND5) J6.2 R1.2 R2.2 R3.2 R6.1 R9.2 R17.1 R18.1 R26.2 R27.1 R34.1 R35.2 R36.2 R37.2 R38.2 R39.1 R53.1 R54.1 R55.1 R56.1 R57.1 R58.1 R59.1 R60.1 R61.1 R62.1 R63.1 R64.1 R65.1 R66.1 R67.1 R68.1 R158.2 R281.1 R282.1 R283.1 R284.1 R285.1 R286.1 R287.1 R288.1 R291.1 R292.1 R293.1 R294.1 S1.2 S1.4 S2.1 S2.3 TP8.P$1(TP) U1.D8(E:DGND) U1.D9(E:DGND) U1.E5(E:DGND) U1.E6(E:DGND) U1.E7(E:DGND) U1.E8(E:DGND) U1.E9(E:DGND) U1.E10(E:DGND) U1.E11(E:DGND) U1.E12(E:DGND) U1.F5(E:DGND) U1.F12(E:DGND) U1.G5(E:DGND) U1.G12(E:DGND) U1.H4(E:DGND) U1.H5(E:DGND) U1.H12(E:DGND) U1.H13(E:DGND) U1.J4(E:DGND) U1.J5(E:DGND) U1.J12(E:DGND) U1.J13(E:DGND) U1.K5(E:DGND) U1.K12(E:DGND) U1.L5(E:DGND) U1.L12(E:DGND) U1.M5(E:DGND) U1.M6(E:DGND) U1.M7(E:DGND) U1.M8(E:DGND) U1.M9(E:DGND) U1.M10(E:DGND) U1.M11(E:DGND) U1.M12(E:DGND) U1.N8(E:DGND) U1.N9(E:DGND) U2.4(GND) U3.3(GND) U4.1(GND) U6.1(*1OE) U6.4(GND) U7.C4(VSSQ1) U7.E7(VSS1) U7.G5(VSS2) U7.H10(VSS3) U7.K8(VSS4) U7.N2(VSSQ2) U7.N5(VSSQ3) U7.P4(VSSQ4) U7.P6(VSSQ5) U8.33(GND_EP) U16.2(GND) U16.5(TESTL) U16.6(XTAMPER) U16.9(GND) U16.18(PIRQ#) U16.19(ATEST) U16.20(TWI_WAKEUP#) U16.21(ATEST) U16.23(GND) U16.24(ATEST) U16.32(GND) U21.4(VSS) U25.3(GND1) U27.2(GND) X1.GND X3.6(VSS) X3.GND X4.8(D_GND) X7.2
GPIO0_18: RTC1.3(SQW) U1.J15(B:USB0_DRVVBUS)
GPIO0_26: U1.R5(C:GPMC_AD10)
GPIO0_27: U1.T5(C:GPMC_AD11)
GPIO1_12: IC2.2(I2) U1.P6(C:GPMC_AD12)
GPIO1_13: IC2.3(I3) U1.R6(C:GPMC_AD13)
GPIO1_14: IC2.4(I4) U1.T6(C:GPMC_AD14)
GPIO1_15: IC2.5(I5) U1.P7(C:GPMC_AD15)
GPIO1_16: U1.T12(C:GPMC_A0) U25.6(!RE) U25.7(DE)
GPIO1_28: U1.N14(C:GPMC_BEN1)
GPIO1_29: U1.P3(C:GPMC_CSN0)
GPIO2_1: U1.T7(C:GPMC_CLK)
GPIO3_21: IC2.1(I1) U1.C4(C:MCASP0_AHCLKX)
HDMI_INT: U1.T15(C:GPMC_A9)
HDMICLK_DISN: U1.T16(C:GPMC_A11)
I2C0_SCL: R12.1 U1.C10(A:I2C0_SCL) U1.D10(A:PMIC_SCL) U16.29(SM_CLK)
I2C0_SDA: R13.1 U1.C11(A:I2C0_SDA) U1.D11(A:PMIC_SDA) U16.30(SM_DAT)
I2C2_SCL: R95.1 RTC1.8(SCL) U1.A10(C:UART1_RTSN)
I2C2_SDA: R96.1 RTC1.7(SDA) U1.B10(C:UART1_CTSN)
ISO_GND: C43.2 C44.2 C45.2 C46.2 D14.A D15.A L3.5 U25.9(GND2_2) U25.15(GND2) U26.2(GND) X13.3
ISO_VIN: C44.1 C45.1 D16.C D17.C U26.1(VIN) U26.3(ON/!OFF)
JTAG_EMU0: J4.13(EMU0) R40.1 U1.E2(B:EMU0)
JTAG_EMU1: J4.14(EMU1) R41.1 U1.E3(B:EMU1)
JTAG_TCK: J4.9(TCKRTN) J4.11(TCK) U1.D1(B:TCK)
JTAG_TDI: J4.3(TDI) U1.C1(B:TDI)
JTAG_TDO: J4.7(TDO) U1.C2(B:TDO)
JTAG_TMS: J4.1(TMS) U1.D2(B:TMS)
JTAG_TRSTN: J4.2(TRSTN) R39.2 U1.D3(B:TRSTN)
LCD_DATA0: J8.9 R68.2 R85.1 U1.G3(D:LCD_DATA0)
LCD_DATA1: J8.10 R67.2 R84.1 U1.G2(D:LCD_DATA1)
LCD_DATA2: J8.7 R66.2 R69.1 R83.1 U1.G1(D:LCD_DATA2)
LCD_DATA3: J8.8 R65.2 R82.1 U1.H3(D:LCD_DATA3)
LCD_DATA4: J8.5 R64.2 R81.1 U1.H2(D:LCD_DATA4)
LCD_DATA5: J8.6 R63.2 R80.1 U1.H1(D:LCD_DATA5)
LCD_DATA6: J8.3 R62.2 R79.1 U1.J3(D:LCD_DATA6)
LCD_DATA7: J8.4 R61.2 R78.1 U1.J2(D:LCD_DATA7)
LCD_DATA8: J8.1 R60.2 R77.1 U1.J1(D:LCD_DATA8)
LCD_DATA9: J8.2 R59.2 R76.1 U1.K3(D:LCD_DATA9)
LCD_DATA10: J7.10 R58.2 R75.1 U1.K2(D:LCD_DATA10)
LCD_DATA11: J7.8 R57.2 R74.1 U1.K1(D:LCD_DATA11)
LCD_DATA12: J7.9 R56.2 R73.1 U1.L3(D:LCD_DATA12)
LCD_DATA13: J7.7 R55.2 R72.1 U1.L2(D:LCD_DATA13)
LCD_DATA14: J7.5 R54.2 R71.1 U1.L1(D:LCD_DATA14)
LCD_DATA15: J7.6 R53.2 R70.1 U1.M3(D:LCD_DATA15)
LCD_DE: J7.4 R28.2
LCD_HSYNC: J7.3 R29.2
LCD_PCLK: J7.2 R31.2
LCD_VSYNC: J7.1 R30.2
LDO_PGOOD: TP22.TP U1.N4(A:PMIC_LDO_PGOOD) U1.N5(A:RTC_PWRONRSTN)
MDIO_CLK: U1.D13(D:MDC) U8.17(MDC)
MDIO_DATA: ER105.2 U1.E13(D:MDIO) U8.16(MDIO)
MII1_COL: ER123.2 U1.F15(D:MII1_COL)
MII1_CRS: ER124.2 U1.F14(D:MII1_CRS)
MII1_RXCLK: ER116.2 U1.E16(D:MII1_RX_CLK)
MII1_RXD0: ER113.2 U1.E14(D:MII1_RXD0)
MII1_RXD1: ER112.2 U1.D16(D:MII1_RXD1)
MII1_RXD2: ER111.2 U1.D15(D:MII1_RXD2)
MII1_RXD3: ER110.2 U1.D14(D:MII1_RXD3)
MII1_RXDV: ER114.2 U1.F16(D:MII1_RX_DV)
MII1_RXERR: ER118.2 U1.E15(D:MII1_RX_ER)
MII1_TXCLK: ER119.2 U1.H16(D:MII1_TX_CLK)
MII1_TXD0: U1.H15(D:MII1_TXD0) U8.22(TXD0)
MII1_TXD1: U1.H14(D:MII1_TXD1) U8.23(TXD1)
MII1_TXD2: U1.G16(D:MII1_TXD2) U8.24(TXD2)
MII1_TXD3: U1.G15(D:MII1_TXD3) U8.25(TXD3)
MII1_TXEN: U1.G14(D:MII1_TX_EN) U8.21(TXEN)
MMC0_CD: J4.19(EMU4) R92.1 U1.C14(C:SPI0_CS1) X3.CD(CD#)
MMC0_CLK: R88.1 U1.B15(C:MMC0_CLK) X3.5(CLK)
MMC0_CMD: R87.1 U1.B16(C:MMC0_CMD) X3.3(CMD/DI)
MMC0_DAT0: R89.1 U1.A16(C:MMC0_DAT0) X3.7(DAT0/DO)
MMC0_DAT1: R90.1 U1.A15(C:MMC0_DAT1) X3.8(DAT1)
MMC0_DAT2: R86.1 U1.C16(C:MMC0_DAT2) X3.1(DAT2)
MMC0_DAT3: R91.1 U1.C15(C:MMC0_DAT3) X3.2(DAT3/CS)
MMC1_CLK: R51.1 U1.P2(C:GPMC_CSN1) U7.M6(CLK)
MMC1_CMD: R50.1 U1.P1(C:GPMC_CSN2) U7.M5(CMD)
MMC1_DAT0: R42.1 U1.R3(C:GPMC_AD0) U7.A3(DAT0)
MMC1_DAT1: R43.1 U1.R2(C:GPMC_AD1) U7.A4(DAT1)
MMC1_DAT2: R44.1 U1.R1(C:GPMC_AD2) U7.A5(DAT2)
MMC1_DAT3: R45.1 U1.T3(C:GPMC_AD3) U7.B2(DAT3)
MMC1_DAT4: R46.1 U1.T2(C:GPMC_AD4) U7.B3(DAT4)
MMC1_DAT5: R47.1 U1.T1(C:GPMC_AD5) U7.B4(DAT5)
MMC1_DAT6: R48.1 U1.P4(C:GPMC_AD6) U7.B5(DAT6)
MMC1_DAT7: R49.1 U1.R4(C:GPMC_AD7) U7.B6(DAT7)
MODE2: ER99.2 ER123.1 U8.15(COL/CRS_DV/MODE2)
N$1: R10.1 X1.VBUS
N$2: D7.2(C) R38.1
N$3: J6.1 R69.2
N$5: R8.2 U4.2(RESET#)
N$6: TP1.TP U1.F4(F:VDDS_DDR)
N$7: D2.2(C) R3.1
N$8: D1.2(C) R26.1
N$9: R15.2 R20.1 U5.1(REF)
N$10: Q1.B R21.1 U5.2(CATHODE)
N$11: D6.2(C) R37.1
N$13: D5.2(C) R36.1
N$14: J11.1 J12.1 R181.1 R214.1 X9.1
N$15: D4.2(C) R35.1
N$16: D10.C U27.7(CANH) X12.3
N$17: D11.C U27.6(CANL) X12.2
N$18: TP2.TP U1.G4(F:VDD_CORE)
N$19: TP3.TP U1.F13(F:VDD_MPU)
N$21: TP4.TP U1.G13(F:VDDS_PLL)
N$22: R4.1 U1.A4(C:XDMA_EVENT_INTR0)
N$23: R161.2 U21.3(W#)
N$24: J51.1 J52.1 R185.1 R254.1 X11.1
N$25: R160.2 U21.7(HOLD#)
N$26: R19.1 U1.R13(C:GPMC_A4)
N$27: R11.1 S1.1 S1.3
N$28: C151.1 J53.1 R254.2 U$6.3(A:+IN)
N$29: J51.2 R251.2
N$30: R5.1 U3.4(Y)
N$31: J53.2 R253.1
N$32: J52.2 R252.1
N$33: R1.1 U1.M16(A:RTC_KALDO_ENN)
N$34: J61.1 J62.1 R186.1 R264.1 X11.3
N$35: D8.2(C) R2.1
N$36: EC40.1 ER122.2 X4.4(TCT) X4.5(RCT)
N$37: D21.2(C) R171.1
N$38: D23.2(C) R173.1
N$39: D22.2(C) R172.1
N$40: IC2.16(O1) K1.2 R171.2
N$41: IC2.15(O2) K2.2 R172.2
N$42: C161.1 J63.1 R264.2 U$6.5(B:+IN)
N$43: D24.2(C) R174.1
N$44: D25.2(C) R175.1
N$45: J11.2 R211.2
N$46: J12.2 R212.1
N$47: J61.2 R261.2
N$48: J63.2 R263.1
N$49: J62.2 R262.1
N$50: IC2.13(O4) K4.2 R174.2
N$51: IC2.12(O5) K5.2 R175.2
N$52: IC2.14(O3) K3.2 R173.2
N$54: J13.2 R213.1
N$55: J21.1 J22.1 R182.1 R224.1 X9.3
N$56: C121.1 J23.1 R224.2 U$3.5(B:+IN)
N$57: G1.+ RTC1.6(VBAT)
N$59: IC4.6(H) R288.2 S12.8
N$60: C111.1 J13.1 R214.2 U$3.3(A:+IN)
N$61: J21.2 R221.2
N$62: J23.2 R223.1
N$63: J22.2 R222.1
N$64: D9.2(C) R9.1
N$65: C4.1 R94.1
N$66: J31.1 J32.1 R183.1 R234.1 X10.1
N$67: C131.1 J33.1 R234.2 U$5.3(A:+IN)
N$68: J31.2 R231.2
N$69: J33.2 R233.1
N$70: R31.1 U1.F1(D:LCD_PCLK)
N$71: J32.2 R232.1
N$72: R30.1 U1.F3(D:LCD_VSYNC)
N$73: J41.1 J42.1 R184.1 R244.1 X10.3
N$74: C141.1 J43.1 R244.2 U$5.5(B:+IN)
N$75: J41.2 R241.2
N$76: J43.2 R243.1
N$77: C4.2 IC1.4(FB) R17.2 R93.1
N$78: J42.2 R242.1
N$79: D14.C F3.2 U25.11(Y) U25.14(A)
N$80: D15.C F4.2 U25.12(Z) U25.13(B)
N$81: F3.1 X13.1
N$82: F4.1 X13.2
N$83: R29.1 U1.F2(D:LCD_HSYNC)
N$84: C43.1 C46.1 U25.16(VCC2) U26.5(VOUT)
N$85: R28.1 U1.E1(D:LCD_AC_BIAS_EN)
N$87: D16.A L3.6
N$88: D17.A L3.4
N$89: L3.1 U25.1(D1)
N$90: L3.3 U25.2(D2)
N$91: IC4.5(G) R287.2 S12.4
N$92: IC4.4(F) R286.2 S12.2
N$93: IC4.3(E) R285.2 S12.1
N$94: IC4.14(D) R284.2 S11.8
N$95: IC4.13(C) R283.2 S11.4
N$96: IC4.12(B) R282.2 S11.2
N$97: IC4.11(A) R281.2 S11.1
N$98: IC5.11(A) R291.2 S13.8
N$99: IC5.12(B) R292.2 S13.7
N$100: IC5.13(C) R293.2 S13.6
N$101: IC5.14(D) R294.2 S13.5
N$102: IC4.10(SER) IC5.9(QH)
N$113: ER126.1 U8.5(XTAL1/CLKIN)
N$114: EC42.1 ER125.2 ER126.2 Y7.P$2
N$115: EC41.1 ER127.2 Y7.P$1
N$116: ER125.1 ER127.1 U8.4(XTAL2)
N$117: ER128.2 U8.32(RBIAS)
N$118: ER129.1 U8.18(NINT/TXER/TXD4)
N$123: ER120.2 U8.2(LED2/!INTSEL) X4.A1(YELA)
N$124: U8.3(LED1/REGOFF) X4.C2(GRNA)
N$125: EC33.1 EC35.1 U8.6(VDDCR)
N$126: ER115.2 X4.C1(YELC)
N$127: ER117.2 X4.A2(GRNC)
OSC0_GND: C7.2 C12.2 U1.N15(B:OSC0_GND)
OSC0_IN: C12.1 R32.2 U1.P16(B:OSC0_IN) Y2.P$2
OSC0_OUT: C7.1 R32.1 U1.N16(B:OSC0_OUT) Y2.P$1
OSC1_GND: RTC1.5(GND) U1.B5(B:OSC1_GND) ; supply symbol labelled GND
OSC1_IN: R24.2 RTC1.1(32KHZ) U1.A6(B:OSC1_IN)
OSC1_OUT: U1.A5(B:OSC1_OUT)
PMIC_INT: TP24.TP U1.D4(A:EXTINTN) U1.E4(A:PMIC_NINT)
PMIC_MUX_IN: R18.2 R22.1 U1.N13(B:PMIC_MUX_IN)
PMIC_NRESET: J2.1 U1.M13(A:PMIC_NRESET)
PMIC_NWAKEUP: TP23.TP U1.L4(A:PMIC_NWAKEUP) U1.M4(A:EXT_WAKEUP)
PMIC_PGOOD: U1.N12(A:PMIC_PGOOD) U1.P11(A:PWRONRSTN) U3.2(A)
PWR_BUT: S2.2 S2.4 U1.T11(A:PMIC_PB_IN)
PWR_EN: TP21.TP U1.N10(A:PMIC_POWER_EN) U1.N11(A:PMIC_PWR_EN)
RESET: R5.2 R11.2 U4.3(MR#)
RTC_RST: RTC1.4(RST) U1.R12(C:GPMC_A1)
RX_CLK: ER104.1 ER116.1 U8.7(RXCLK/PHYAD1)
RX_DV: ER114.1 U8.26(RXDV)
RX_ERR: ER101.1 ER118.1 U8.13(RXER/RXD4/PHYAD0)
RX_N: EC37.1 ER107.2 U8.30(RXN) X4.2(RXN)
RX_P: EC36.1 ER106.2 U8.31(RXP) X4.1(RXP)
RXD0: ER98.2 ER113.1 U8.11(RXD0/MODE0)
RXD1: ER100.2 ER112.1 U8.10(RXD1/MODE1)
RXD2: ER103.1 ER111.1 U8.9(RXD2/RMIISEL)
RXD3: ER102.1 ER110.1 U8.8(RXD3/PHYAD2)
SPI0_CS0: R158.1 TP30.TP U1.A14(C:SPI0_CS0) U21.1(S#)
SPI0_D0(MISO): TP29.TP U1.B13(C:SPI0_D0) U21.2(DQ1)
SPI0_D1(MOSI): TP28.TP U1.B14(C:SPI0_D1) U21.5(DQ0)
SPI0_SCLK: TP27.TP U1.A13(C:SPI0_SCLK) U21.6(C)
SPI1_CS0: IC4.1(SH/!LD) IC5.1(SH/!LD) U1.B1(C:MCASP0_AHCLKR)
SPI1_D0: IC4.9(QH) U1.A2(C:MCASP0_FSX)
SPI1_D1: U1.B2(C:MCASP0_AXR0)
SPI1_SCLK: IC4.2(CLK) IC5.2(CLK) U1.A1(C:MCASP0_ACLKX)
SYS_ADC_1P8V: C10.1 R33.2 U1.A7(B:SYS_ADC_1P8V) U$4.3(+IN)
SYS_RESETN: C14.1 J4.15(SRST) R6.2 R8.1 TP26.P$1(TP) U1.R11(A:WARMRSTN) U8.19(!RST) U16.17(LRESET#)
SYS_RTC_1P8V: Q1.C R15.1 TP14.TP U1.K11(A:SYS_RTC_1P8V) U1.L11(A:SYS_RTC_1P8V) U3.5(VCC) U5.3(ANODE)
SYS_VDD1_3P3V: C6.2 C15.1 C16.2 C17.2 C18.2 C19.2 C20.2 C21.1 C22.1 C41.1 C42.1 C79.1 C85.1 C87.1 C88.1 C93.1 C97.1 EC34.1 ER98.1 ER99.1 ER100.1 ER105.1 FB7.1 J4.5(TVDD) L3.2 R12.2 R13.2 R22.2 R24.1 R40.2 R41.2 R42.2 R43.2 R44.2 R45.2 R46.2 R47.2 R48.2 R49.2 R50.2 R51.2 R52.2 R70.2 R71.2 R72.2 R73.2 R74.2 R75.2 R76.2 R77.2 R78.2 R79.2 R80.2 R81.2 R82.2 R83.2 R84.2 R85.2 R86.2 R87.2 R88.2 R89.2 R90.2 R91.2 R92.2 R95.2 R96.2 R160.1 R161.1 RTC1.2(VCC) S11.C S12.C S13.1 S13.2 S13.3 S13.4 TP12.TP U1.F6(A:SYS_VDD1_3P3V) U1.F7(A:SYS_VDD1_3P3V) U1.G6(A:SYS_VDD1_3P3V) U1.G7(A:SYS_VDD1_3P3V) U4.4(VCC) U6.7(2OE) U6.8(VCC) U7.C6(VCCQ1) U7.E6(VCC1) U7.F5(VCC2) U7.J10(VCC3) U7.K9(VCC4) U7.M4(VCCQ2) U7.N4(VCCQ3) U7.P3(VCCQ4) U7.P5(VCCQ5) U8.12(VDDIO) U16.1(VCC) U16.8(VCC) U16.22(VCC) U21.8(VCC) U25.4(VCC1) U27.3(VCC) U$4.5(V+) X3.4(VDD)
SYS_VDD2_3P3V: D1.1(A) TP13.TP U1.F11(A:SYS_VDD2_3P3V) U1.G11(A:SYS_VDD2_3P3V)
SYS_VDD3_3P3V: Q1.E R20.2 R21.2 TP16.TP U1.F8(A:SYS_VDD3_3P3V) U1.F9(A:VDDSHV4) U1.G8(A:SYS_VDD3_3P3V) U1.G9(A:VDDSHV5) U1.H7(A:SYS_VDD3_3P3V) U1.H8(A:SYS_VDD3_3P3V) U1.H9(A:VDDSHV6) U1.J7(A:SYS_VDD3_3P3V) U1.J8(A:SYS_VDD3_3P3V) U1.J9(A:VDDSHV1) U1.K8(A:SYS_VDD3_3P3V) U1.K9(A:VDDSHV2) U1.L8(A:SYS_VDD3_3P3V) U1.L9(A:VDDSHV3)
SYS_VDD_1P8V: TP15.TP U1.F10(A:SYS_VDD_1P8V) U1.G10(A:SYS_VDD_1P8V) U1.H10(A:SYS_VDD_1P8V) U1.H11(A:SYS_VDD_1P8V) U1.J10(A:SYS_VDD_1P8V) U1.J11(A:SYS_VDD_1P8V) U1.K10(A:SYS_VDD_1P8V) U1.L10(A:SYS_VDD_1P8V)
SYS_VOUT: U1.K6(A:SYS_VOUT) U1.K7(A:SYS_VOUT) U1.L6(A:SYS_VOUT) U1.L7(A:SYS_VOUT)
TEMP_SENSE: TP7.P$1(TP) U1.N6(A:PMIC_TS)
TIMER4: U1.M1(C:GPMC_ADVN_ALE)
TIMER5: U1.N3(C:GPMC_BEN0_CLE)
TIMER6: U1.N2(C:GPMC_WEN)
TIMER7: U1.N1(C:GPMC_OEN_REN)
TPM_GPIO0: U1.B3(C:MCASP0_FSR) U16.12(GPIO)
TPM_GPIO1: TP9.P$1(TP) U1.C12(C:UART0_CTSN) U16.3(GPIO-EXPRESS-00)
TPM_GPIO2: TP10.P$1(TP) U1.C13(C:UART0_RTSN) U16.4(PP/GPIO)
TX_CLK: ER119.1 U8.20(TXCLK)
TX_N: EC39.1 ER109.2 U8.28(TXN) X4.6(TXN)
TX_P: EC38.1 ER108.2 U8.29(TXP) X4.3(TXP)
UART0_RX: U1.A12(C:UART0_RXD) U6.6(1Y)
UART0_TX: U1.B12(C:UART0_TXD) U6.5(2A)
UART1_RXD: U1.A11(C:UART1_RXD) U27.4(RXD)
UART1_TXD: U1.B11(C:UART1_TXD) U27.1(TXD)
UART4_RXD: D9.1(A) U1.P15(C:GPMC_WAIT0) U25.5(R)
UART4_TXD: D8.1(A) U1.R16(C:GPMC_WPN) U25.8(D)
USB0_DM: U1.K16(B:USB0_DM) U2.1(D-) X1.D-
USB0_DP: U1.K15(B:USB0_DP) U2.2(D+) X1.D+
USB0_ID: U1.K14(B:USB0_ID) U2.3(ID) X1.ID
USB1_OCN: U1.R15(C:GPMC_A10)
USR0: D7.1(A) U1.P13(C:GPMC_A5)
USR1: D6.1(A) U1.T14(C:GPMC_A6)
USR2: D5.1(A) U1.R14(C:GPMC_A7)
USR3: D4.1(A) U1.P14(C:GPMC_A8)
VDD_5V: C11.+ C96.1 L2.2 R93.2 R94.2 U1.P10(A:VIN_AC) U1.R10(A:VIN_AC) U1.T10(A:VIN_AC)
VDD_BAT: TP5.P$1(TP) U1.P8(A:VIN_BAT) U1.R8(A:VIN_BAT) U1.T8(A:VIN_BAT)
VDD_ETH_PHY: EC30.1 EC31.1 EC32.1 ER106.1 ER107.1 ER108.1 ER109.1 ER122.1 FB7.2 U8.1(VDD2A) U8.27(VDD1A)
VDD_USB_5V: C3.1 R10.2 U1.J16(B:USB0_VBUS) U1.P9(A:VIN_USB) U1.R9(A:VIN_USB) U1.T9(A:VIN_USB) U2.6(VBUS)
VREFN: R25.1 U1.B9(B:VREFN)
VREFP: C8.1 C9.1 R33.1 U1.B7(B:VREFP)
XDMA_EVENT_INTR0: C1.2 J4.17(EMU2) R4.2
Unconnected: FUD1.P$1 FUD2.P$1 FUD3.P$1 FUD4.P$1 FUD5.P$1 FUD6.P$1 G1.+@1(+) IC2.6(I6) IC2.7(I7) IC2.10(O7) IC2.11(O6) IC4.7(!QH) IC5.7(!QH) IC5.10(SER) J3.2 J3.3 J3.6 J4.6(NC) K1.NC(2:O) K2.NC(2:O) K3.NC(2:O) K4.NC(2:O) K5.NC(2:O) U1.A3(C:MCASP0_ACLKR) U1.C3(C:MCASP0_AXR1) U1.C5(C:ECAP0_IN_PWM0_OUT) U1.D5(F:CAP_VDD_RTC) U1.D12(F:NC) U1.H6(F:VPP) U1.J6(F:NC) U1.J14(D:RMII1_REF_CLK) U1.K4(F:NC) U1.K13(B:USB0_CE) U1.L13(B:USB1_CE) U1.L14(B:USB1_ID) U1.L15(B:USB1_DP) U1.L16(B:USB1_DM) U1.M14(B:USB1_DRVVBUS) U1.M15(B:USB1_VBUS) U1.R7(C:GPMC_CSN3) U2.5(N.C.) U3.1(NC) U16.7(NC) U16.10(NC) U16.11(NC) U16.13(NC) U16.14(NC) U16.15(NC) U16.16(NC) U16.25(NC) U16.26(NC) U16.27(NC) U16.28(NC) U16.31(NC) U16.33(PAD) U21.PAD U25.10(NC) U26.4(BYPASS) U27.8(S) X4.7(NC)

## Notes on the sheet
- Universal Inputs
- Power Supply | Notes
- UI-1 Jumper:
  Therm / Relay
- Rev 0:  
      1)  Initial Release.
- UI-1 Jumper:
  4-20mA
- UI-1 Jumper:
  0-10V
- UI-2 Jumper:
  Therm / Relay
- UI-2 Jumper:
  4-20mA
- UI-2 Jumper:
  0-10V
- UI-3 Jumper:
  Therm / Relay
- UI-3 Jumper:
  4-20mA
- UI-3 Jumper:
  0-10V
- UI-4 Jumper:
  Therm / Relay
- UI-4 Jumper:
  4-20mA
- UI-4 Jumper:
  0-10V
- UI-5 Jumper:
  Therm / Relay
- UI-5 Jumper:
  4-20mA
- UI-5 Jumper:
  0-10V
- UI-6 Jumper:
  Therm / Relay
- UI-6 Jumper:
  4-20mA
- UI-6 Jumper:
  0-10V
- External Real Time Clk | User Config Switches | Secure NOR Boot Flash | Relay Outputs
- There are many footprint compatible
  (8-WSON) parts for the NOR flash
  if the listed part is not available.
- TPM
- 10/12 | 11/12 | 12/12
- Beaglebone Ethernet | RS-485 Interface
- CAN Interface
- PHY Configuration
- 7/12 | 8/12 | 9/12
- SiP GND & Misc | Boot configuration
- Micro SD card slot
- SYSBOOT[15:0] functionality can be found
  in the "SYSBOOT Configuration Pins" section
  of the AM335x TRM (spruh73)
- LCD Headers
- SYSBOOT[15:0] = 0x401C (default)
    - Boot Order: MMC1, MMC0, UART0, USB0
  
  SYSBOOT[15:0] = 0x4018 (SD boot)
    - Boot Order: SPI0, MMC0, USB0, UART0
- BOOT Select Jumper:
  On for SDC Boot
- eMMC
- Configuration:
    - 24 MHz Crystal (SYSBOOT[14:15] = 01b)
    - CLKOUT1 disabled (SYSBOOT[5] = 0b)
- JTAG Header
- Half of these resistors, i.e. the ones marked 
  with 'DNI', can be removed.  Only 16 resistors 
  are needed in order to select the default boot 
  mode.  The button above is used to choose an 
  optional SD card boot mode.
- The eMMC No-Connect (NC) pins for this footprint 
  are purely structural and can be routed through. 
  While this will cause "design errors", they can 
  be safely ignored.  This will allow you to use 
  6/6 mil trace/space throughout the board.
- Mounting Holes | Fiducials | User LEDs
- Mounting holes and other connector shields are part
  of a ground ring, CGND.  This ring is connected to 
  ground via a resistor on Page 1.
- Only connect EMU2, EMU3 and EMU4 if you plan to use advanced JTAG features 
  (HS-RTDX, Core Trace, System Trace, etc) of higher end debuggers:
  
      - http://processors.wiki.ti.com/index.php/JTAG_Connectors
      - http://processors.wiki.ti.com/index.php/XDS_Target_Connection_Guide
- Rev 3 uses the 16GB SDIN8DE2-16G eMMC. Please choose an appropriate 
  footprint compatible eMMC based on size and availability.
- 4/12 | 5/12 | 6/12
- Power & Reset | Clocks, Analog & USB | SiP Interfaces
- Octavo Systems OSD335x-SM
  Reference, Evaluation and Development (RED) Platform
  
  (c) Copyright, Octavo Systems LLC, 2017
        All Rights Reserved.
- Clock resistors R32 and R24 may not be needed in your design.
  See https://octavosystems.com/osd335x/clock/ for more information.
- UART0 debug header
- If the analog interface is not used, 
  then VREFP and VREFN should be 
  shorted to AGND.
- THERE IS NO WARRANTY FOR THIS DESIGN, TO THE EXTENT 
  PERMITTED BY APPLICABLE LAW. EXCEPT WHEN OTHERWISE 
  STATED IN WRITING THE COPYRIGHT HOLDERS AND/OR OTHER 
  PARTIES PROVIDE THE DESIGN *AS IS* WITHOUT WARRANTY OF 
  ANY KIND, EITHER EXPRESSED OR IMPLIED, INCLUDING, BUT NOT 
  LIMITED TO, THE IMPLIED WARRANTIES OF MERCHANTABILITY 
  AND FITNESS A FOR A PARTICULAR PURPOSE. THE ENTIRE RISK 
  AS TO THE QUALITY AND PERFORMANCE OF THE DESIGN IS WITH 
  YOU. SHOULD THE DESIGN PROVE DEFECTIVE, YOU ASSUME THE 
  COST OF ALL NECESSARY SERVICING, REPAIR OR CORRECTION.
- SYS_ADC_1P8V and AGND_ADC are connected
  to SYS_VDD_1P8V and DGND, respectively, 
  through ferrite beads inside the SiP.  It is 
  not necessary to connect these rails to 
  anything else.  However, bypass capacitors 
  should be added to reduce noise, if needed 
  for your application.
- Battery Connector
- Maximum voltage for the analog 
  inputs is 1.8V.
- 32kHz Oscillator is used for 
  RTC.  If your application 
  does not use the RTC, then 
  this can be removed.
- This is a clamping circuit between the SYS_RTC_1P8V 
  and SYS_VDD3_3P3V outputs of the TPS65217
  power management IC inside the OSD335x-SM.  The
  clamping circuit is related to power down issues 
  (see https://octavosystems.com/osd335x/clamping/ 
  for more information). This may not be needed in 
  your application if the power down conditions do 
  not apply to your application.
- AIN7 currently monitors the PMIC voltages 
  via the internal PMIC mux.  See the `Analog 
  Multiplexer' section of the TPS65217 
  datasheet.  For the internal PMIC voltages, 
  there are dividers within the PMIC to keep 
  the montiored voltages under 1.8V.  However, 
  PMIC_MUX_IN does not have any dividers 
  and must be less than 1.8V.  By default, 
  PMIC_MUX_OUT is Hi-Z.  The MUXCTRL 
  register in the PMIC is used to select the 
  PMIC_MUX_OUT voltage path.
- The 0 Ohm resistor (R10) on the 
  VBUS input can be replaced with 
  a ferrite bead for noise 
  suppresion or a solder bridge 
  for cost reduction.
- Reset supervisor circuit
- SYS_VDD1_3P3V is a 3.3V output of the 
  OSD3358-512M-BSM.  A divide by 2 resistor 
  divider is used to ensure that the PMIC_MUX_IN 
  voltage does not exceed 1.8V.  It is not 
  necessary to monitor the TL5209 LDO output 
  and this can be removed if desired.
- Resistor and capacitor footprints 
  are added to CLKOUT1/CLKOUT2 in 
  case EMI suppression is needed.
- USB Client
- RTC_KALDO_ENN is grounded thru a 10K ohm resistor so that 
  the internal RTC LDO is enabled and CAP_VDD_RTC does not 
  need to be connected to VDD_CORE.
- Reset inputs:
      1) Manual push-button
      2) PMIC_PGOOD
  Reset supervisor MR# has internal pull up to SYS_VDD1_3P3V.  Each 
  reset input is effectively open drain and can only pull reset line 
  low. Resistors added only for debug and are not necessary.
- To Print:  Use 8.5"x11" paper in landscape; 0.69 scaling factor.
- 1/12 | 2/12 | 3/12

## Power pins joined to a net without a drawn wire
GND: IC4.8(GND) IC5.8(GND)
SYS_VDD1_3P3V: IC4.16(VCC) IC5.16(VCC)
VIO: U27.5(VIO)

## Library data of the parts
C1-C4 C6-C10 C12-C22 C41-C45 C79 C85 C87 C88 C93 C97 C111 C121 C131 C141 C151 C161 EC30-EC42 = OSD3358-SM-RED Platform:C: Capacitor SMD. Sizes: 0402, 0603 & 0805
C11 = OSD3358-SM-RED Platform:CPOL-US: POLARIZED CAPACITOR, American symbol
C46 C95 C96 = SparkFun-Capacitors:4.7UF: 4.7µF ceramic capacitors A capacitor is a passive two-terminal electrical component used to store electrical energy temporarily in an electric field.; PROD_ID: CAP-10300
C94 = SparkFun-Capacitors:1000UF: 1,000µF/1mF ceramic capacitors A capacitor is a passive two-terminal electrical component used to store electrical energy temporarily in an electric field. CAP-08070; PROD_ID: CAP-09538
D1 D2 D9 D21-D25 = OSD3358-SM-RED Platform:LTST-C191KFKT: PointLED® Enhanced Thinfilm LED TOP & BOTTOM mount EIA-STD, P47F
D3 = diode:S1M
D4-D8 = OSD3358-SM-RED Platform:LTST-C191KGKT: PointLED® Enhanced Thinfilm LED TOP & BOTTOM mount EIA-STD, P47F
D10 D11 D14 D15 = diode:SUPPRESSOR-: Suppressor diode
D13 = OSD3358-SM-RED Platform:B520C-13-F: Schottky barrier diode Source: www.st.com, BAT60J.pdf
D16 D17 = diode:MBR0520LT: SCHOTTKY BARRIER RECTIFIER Source: http://onsemi.com .. MBR0520LT1-D.pdf
ER98-ER120 ER122-ER129 R1-R6 R8-R13 R15 R17-R22 R24-R96 R158 R160 R161 R171-R175 R212-R214 R222-R224 R232-R234 R242-R244 R252-R254 R262-R264 R281-R288 R291-R294 = OSD3358-SM-RED Platform:R-US_: RESISTOR, American symbol
F1 = OSD3358-SM-RED Platform:FUSE
F3 F4 = MICROSMD010F-2:MICROSMD010F-2; MANUFACTURER_PART_NUMBER: MICROSMD010F2; VENDOR: Littlefuse
FB7 = OSD3358-SM-RED Platform:BLM21AG151SN1D: INDUCTOR SMD Ferrite Bead Packages: 0805, 1206
FUD1-FUD6 = OSD3358-SM-RED Platform:FIDUCIAL
G1 = battery:CR2032V: LI BATTERY Varta
IC1 = linear:LM2596S: STEP-DOWN VOLTAGE REGULATOR
IC2 = uln-udn:ULN2003A: DRIVER ARRAY
IC3 = v-reg:78XXL: VOLTAGE REGULATOR
IC4 IC5 = 74xx-eu:74*165: 8-bit parallel load SHIFT REGISTER
J1 J2 J6 J11-J13 J21-J23 J31-J33 J41-J43 J51-J53 J61-J63 = OSD3358-SM-RED Platform:826646-2: 2-pin 100 mil header
J3 = OSD3358-SM-RED Platform:826646-6: 6-pin 100 mil header; MPN: P125-1106A1BS116A1
J4 = OSD3358-SM-RED Platform:CTI-JTAG
J7 J8 = OSD3358-SM-RED Platform:TH-2X5: 320030002
K1-K5 = relay:JS-M1*: Automotive Ultra-Miniature Power Relay NAiS Source: http://www.mew-europe.com/.. en_ds_61211_0000.pdf; MF: FARNELL; MPN: JSM1-12V-5; OC_FARNELL: 910351; OC_NEWARK: 14J1764
L2 = inductor-coilcraft_l:MSS1260: SMT Power Inductor
L3 = murata_xfmr:78253/55MVC-R; MANUFACTURER_PART_NUMBER: 7825355MVCR; VENDOR: Murata
MGT1-MGT4 = OSD3358-SM-RED Platform:MOUNTING_HOLE: Chassis Mounting Hole w/GND connection ability
Q1 = OSD3358-SM-RED Platform:MMBT2907*: PNP Transistror
R181-R186 = varistor:VARISTOR: VARISTOR
R211 R221 R231 R241 R251 R261 = resistor:R-US_: RESISTOR, American symbol
RTC1 = SparkFun-Clocks:DS3231M: DS3231M Real Time Clock Accuracy +/-5ppm. Battery Backup. 2.3V to 5.5V. Datasheet <https://cdn.sparkfun.com/datasheets/Dev/Beagle/DS3231M.pdf> SparkFun Products CryptoCape <https://www.sparkfun.com/products/12773> (DEV-12773) SparkFun CryptoShield <https://www.sparkfun.com/products/13183> (DEV-13183); PROD_ID: IC-11985
S1 S2 = OSD3358-SM-RED Platform:KMR231GLFS
S11 S12 = switch-dil:P101: DIL/CODE SWITCH; OC_FARNELL: unknown; OC_NEWARK: unknown
S13 = switch-dil:DS04: DIL/CODE SWITCH; OC_FARNELL: 9471570; OC_NEWARK: unknown
TP1-TP4 TP12-TP16 TP21-TP24 TP27-TP30 = OSD3358-SM-RED Platform:TP: Test pad
TP5-TP10 TP26 = OSD3358-SM-RED Platform:TESTPAD/W_HOLE_1X1: Test point (Through hole)
U1 = OSD3358-SM-RED Platform:OSD3358-512M-BSM: Octavo Systems LLC OSD335x Family SiP: 21mm x 21mm, 1.27mm pitch 256 pin BGA contains AM3358, 512MB DDR3, TPS65217, TL5209, EEPROM and passives. Commerical Temperature: 0C to 85C.
U2 = OSD3358-SM-RED Platform:TPD4S012_DRY_6; DATASHEETURL: http://www.ti.com/lit/gpn/TPD4S012; FAMILY_NAME: ESD Solution; GENERIC_PART_NUMBER: TPD4S012; INDUSTRY_STD_PKG_TYPE: SON; MANUFACTURER: Texas Instruments; MANUFACTURER_PART_NUMBER: tpd4s012_dry_6; PACKAGE_DESIGNATOR: DRY; PIN_COUNT: 6; VENDOR: Texas Instruments
U3 = OSD3358-SM-RED Platform:SN74LVC1G07_DCK_5; DATASHEETURL: http://www.ti.com/lit/gpn/SN74LVC1G07; FAMILY_NAME: LL BUFFER AND DRIVER WITH OPEN-DRAIN OUTPUT; GENERIC_PART_NUMBER: SN74LVC1G07; INDUSTRY_STD_PKG_TYPE: SC70; MANUFACTURER: Texas Instruments; MANUFACTURER_PART_NUMBER: sn74lvc1g07_dck_5; PACKAGE_DESIGNATOR: DCK; PIN_COUNT: 5; VENDOR: Texas Instruments
U4 = OSD3358-SM-RED Platform:APX811: Diodes APX811/812 4-pin Microprocessor Supervisor with Manual Reset. Datasheet <https://www.diodes.com/assets/Datasheets/APX811_812.pdf> Footprint <https://www.diodes.com/assets/Package-Files/SOT143.pdf> Digikey <http://www.digikey.com/products/en?keywords=APX811-29UG-7DICT-ND> Footprint compatible devices: STM811 <http://www.st.com/content/st_com/en/products/reset-and-supervisor-ics/resets-and-voltage-detectors/stm811.html> Digikey <http://www.digikey.com/product-detail/en/stmicroelectronics/STM811SW16F/497-3348-1-ND> STM6315 <http://www.st.com/content/st_com/en/products/reset-and-supervisor-ics/resets-and-voltage-detectors/stm6315.html> Digikey <http://www.digikey.com/product-detail/en/stmicroelectronics/STM6315SDW13F/497-4975-1-ND> ADM811
U5 = OSD3358-SM-RED Platform:TLVH431
U6 = OSD3358-SM-RED Platform:SN74LVC2G241_DCU_8; DATASHEETURL: http://www.ti.com/lit/gpn/SN74LVC2G241; FAMILY_NAME: LL BUFFER AND DRIVER WITH 3-STATE OUTPUT; GENERIC_PART_NUMBER: SN74LVC2G241; INDUSTRY_STD_PKG_TYPE: US8; MANUFACTURER: Texas Instruments; MANUFACTURER_PART_NUMBER: sn74lvc2g241_dcu_8; PACKAGE_DESIGNATOR: DCU; PIN_COUNT: 8; VENDOR: Texas Instruments
U7 = OSD3358-SM-RED Platform:EMMC04G-S100-B08U
U8 = OSD3358-SM-RED Platform:LAN8710
U16 = OSD3358-SM-RED Platform:AT97SC3205T-G3M4400B: Trusted Platform Module
U21 = OSD3358-SM-RED Platform:S25FL127S: Cypress Semiconductor S25FL127S http://www.cypress.com/file/177961/download https://www.digikey.com/product-detail/en/cypress-semiconductor-corp/S25FL127SABNFI101/1274-1046-ND/4142072
U25 = ISO3086TDW:ISO3086TDW; MANUFACTURER_PART_NUMBER: ISO3086TDW; VENDOR: Texas Instruments
U26 = LP2985A-33DBVR:LP2985A-33DBVR; MANUFACTURER_PART_NUMBER: LP2985A33DBVR; VENDOR: Texas Instruments
U27 = BeagleBone_Blue:TCAN1051HV; DATASHEETURL: http://www.ti.com/lit/ds/symlink/tcan1051hv.pdf; DESCRIPTION: CAN Transceiver; FAMILY_NAME: CAN Transceiver; GENERIC_PART_NUMBER: TCAN1051HV; INDUSTRY_STD_PKG_TYPE: SOIC; MANUFACTURER: Texas Instruments; MANUFACTURER_PART_NUMBER: TCAN1051HVD; PACKAGE_DESIGNATOR: D; PIN_COUNT: 8; VENDOR: Texas Instruments
U$3 U$5 U$6 = adam - ics:MCP6002: Dual General Op Amp 1.8V min supply 1MHz (6V/us)
U$4 = adam - ics:MCP6001: General Op Amp 1.8V min supply 1MHz (6V/us)
X1 = OSD3358-SM-RED Platform:10118192-0001LF: Amphenol FCI Micro USB Type B Complete Surface Mount (SMT) no guide holes
X2 = con-phoenix-381_l:MC2: Mini-Combicon 3.81mm horizontal 2-polig MC 1,5/2-G-3,81 Artikel-Nr. 1803277
X3 = OSD3358-SM-RED Platform:DM3BT-DSF-PEJS: HIROSE - microSD Card socket - Reverse on-Board - Push / Push
X4 = OSD3358-SM-RED Platform:LPJ0011BBNL: Ethernet Connector MagJack (R) Source: www.stewartconnector.com .. si-50170.pdf; OC_FARNELL: unknown; OC_NEWARK: unknown
X7 = con-phoenix-508:MSTBA2: PHOENIX; MF: FARNELL; MPN: 1757242; OC_FARNELL: 3705171; OC_NEWARK: 71C4161
X8 = con-phoenix-381_l:MC10: Mini-Combicon 3.81mm horizontal 10-polig MC 1,5/10-G-3,81 Artikel-Nr. 1803358
X9-X11 = con-phoenix-381_l:MC4: Mini-Combicon 3.81mm horizontal 4-polig MC 1,5/4-G-3,81 Artikel-Nr. 1803293
X12 = con-phoenix-381_l:MC3: Mini-Combicon 3.81mm horizontal 3-polig MC 1,5/3-G-3,81 Artikel-Nr. 1803280
X13 = con-phoenix-508:MSTBA3: PHOENIX; MF: FARNELL; MPN: 1757255; OC_FARNELL: 3705183; OC_NEWARK: 71C4162
Y2 = OSD3358-SM-RED Platform:7A-24.000MAAJ-T
Y7 = OSD3358-SM-RED Platform:7A-25.000MAAE-T: 25MHz crystal

## Net classes
0 default: width 0.127 mm, drill 0.254 mm
1 ground: width 0.152 mm, drill 0.254 mm, clearance 0.152 mm